# Altium project LAUNCHXL-F28379D.PrjPcb
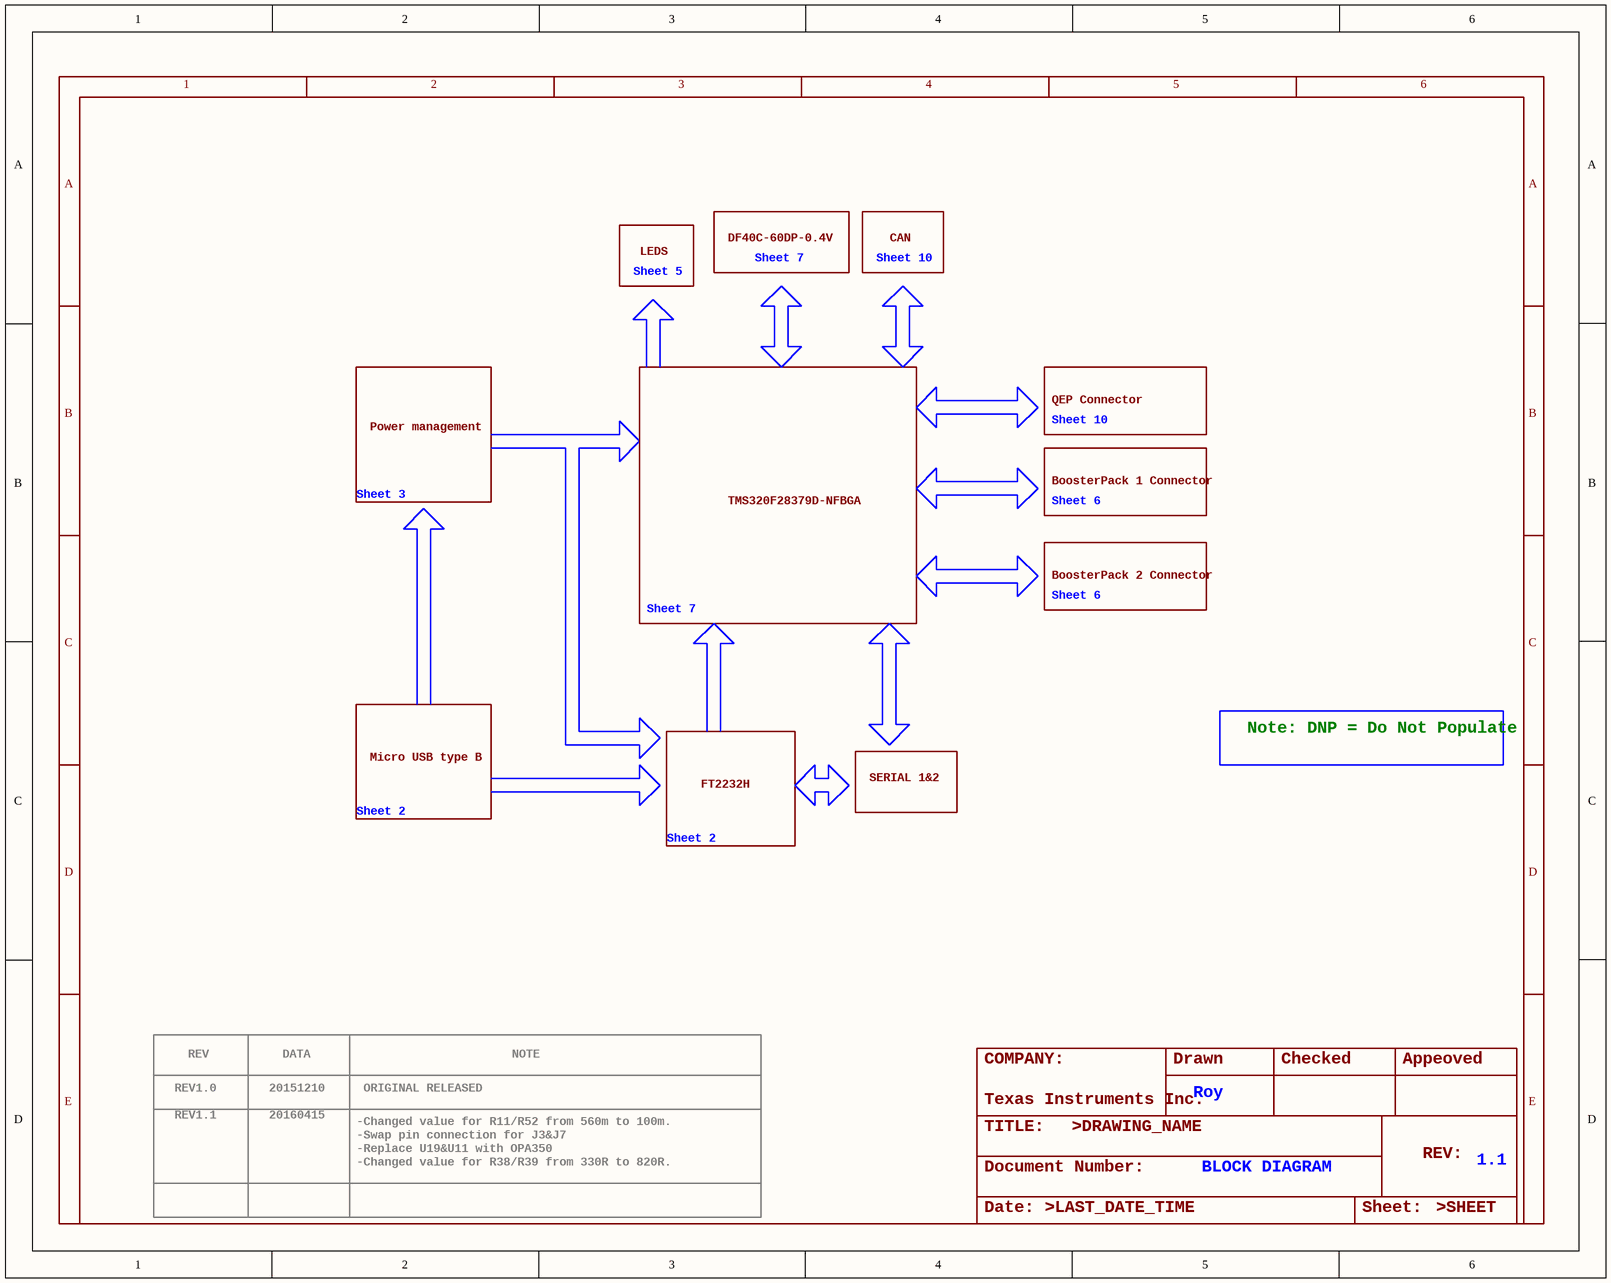
[diagram p0: LAUNCHXL-F28379D_0.SchDoc]
10 sheets, 230 parts. Net scope: global (net labels, ports and power ports of the same name join across sheets).
Sheets:
  LAUNCHXL-F28379D_0.SchDoc
  LAUNCHXL-F28379D_1.SchDoc
  LAUNCHXL-F28379D_2.SchDoc
  LAUNCHXL-F28379D_3.SchDoc
  LAUNCHXL-F28379D_4.SchDoc
  LAUNCHXL-F28379D_5.SchDoc
  LAUNCHXL-F28379D_6.SchDoc
  LAUNCHXL-F28379D_7.SchDoc
  LAUNCHXL-F28379D_8.SchDoc
  LAUNCHXL-F28379D_9.SchDoc

## Sheet LAUNCHXL-F28379D_0.SchDoc
size 301 x 239 mm

### Parts
FRAME3  FRAME_A_L  (value not drawn)

### Notes on the sheet
- Sheet 5
- LEDS
- DF40C-60DP-0.4V
- Sheet 7
- Sheet 10
- CAN
- QEP Connector
- Sheet 3
- Power management
- BoosterPack 1 Connector
- TMS320F28379D-NFBGA
- Sheet 6
- BoosterPack 2 Connector
- Micro USB type B
- Note: DNP = Do Not Populate
- Sheet 2
- FT2232H
- SERIAL 1&2
- REV1.0
- REV
- 20151210
- DATA
- ORIGINAL RELEASED
- NOTE
- COMPANY:
- Drawn
- Roy
- Checked
- Appeoved
- REV1.1
- 20160415
- -Changed value for R11/R52 from 560m to 100m.
- -Swap pin connection for J3&J7
- -Replace U19&U11 with OPA350
- -Changed value for R38/R39 from 330R to 820R.
- TITLE:
- Document Number:
- Texas
  Instruments Inc.
- >DRAWING_NAME
- BLOCK DIAGRAM
- REV:
- 1.1
- Date:
- >LAST_DATE_TIME
- Sheet:
- >SHEET
- (in symbol FRAME_A_L) 1; 2; 3; 4; 5; 6; A; B; C; D; E

### Library data of the parts
FRAME3 = FRAME_A_L: <b>FRAME</b> A Size , 8 1/2 x 11 INCH, Landscape<p>

## Sheet LAUNCHXL-F28379D_1.SchDoc
size 301 x 239 mm
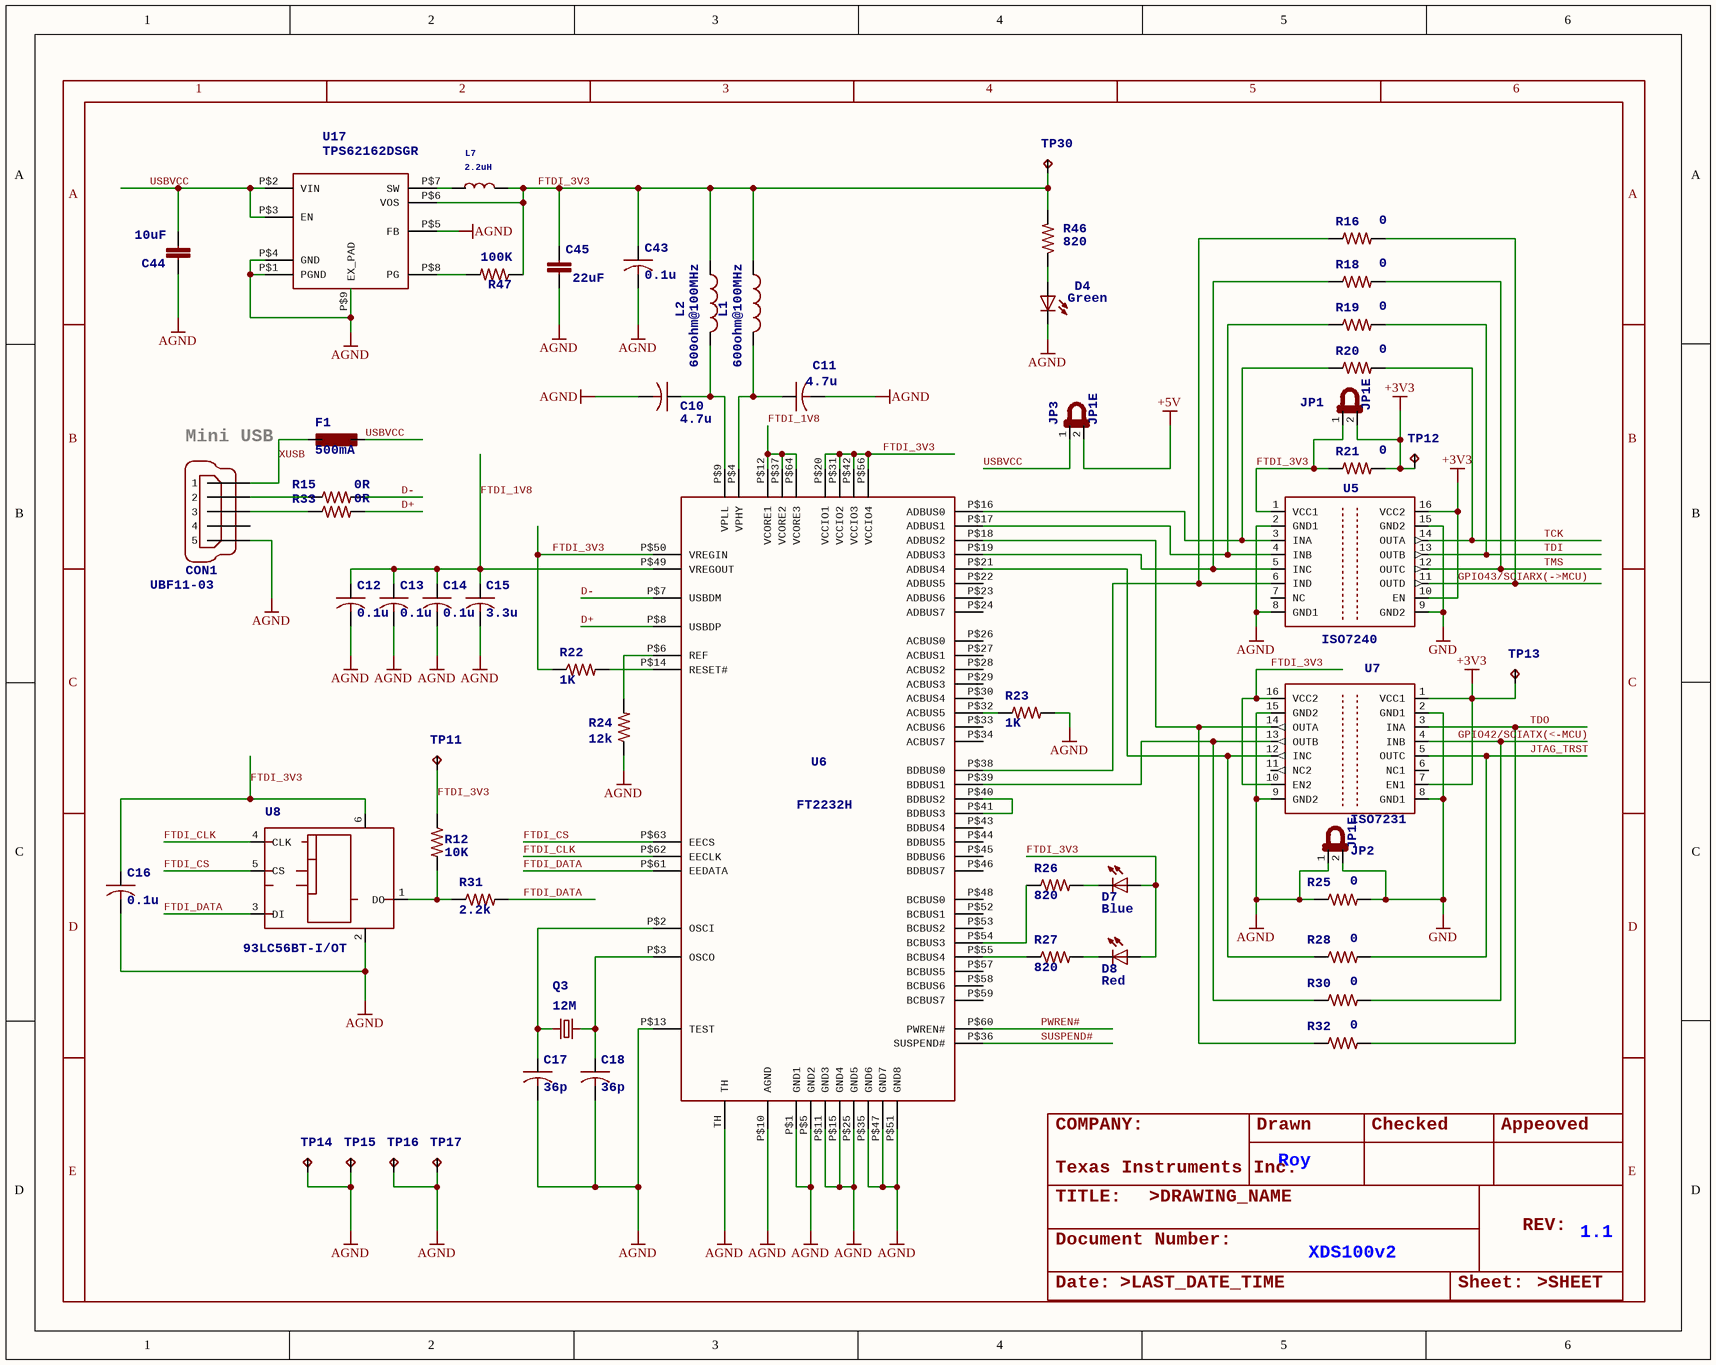
[diagram p1: LAUNCHXL-F28379D_1.SchDoc]

### Parts
C10  4.7u  [C0402]
C11  4.7u  [C0402]
C12  0.1u  [C0402]
C13  0.1u  [C0402]
C14  0.1u  [C0402]
C15  3.3u  [C0402]
C16  0.1u  [C0402]
C17  36p  [C0402]
C18  36p  [C0402]
C43  0.1u  [C0402]
C44  10uF  [SPARKFUN_1210]
C45  22uF  [SPARKFUN_1210]
CON1  UBF11-03  [32005-201]
D4  Green  [CHIP-LED0603]
D7  Blue  [CHIP-LED0603]
D8  Red  [CHIP-LED0603]
F1  500mA  [L1812]
JP1  JP1E  [JP1]
JP2  JP1E  [JP1]
JP3  JP1E  [JP1]
L1  600ohm@100MHz  [R0402]
L2  600ohm@100MHz  [R0402]
L7  2.2uH  [INDUCT-3.2*3.2]
Q3  12M  [HC49UP]
R12  10K  [R0402]
R15  0R  [R0402]
R16  0  [R1206]
R18  0  [R1206]
R19  0  [R1206]
R20  0  [R1206]
R21  0  [R1206]
R22  1K  [R0402]
R23  1K  [R0402]
R24  12k  [R0402]
R25  0  [R1206]
R26  820  [R0402]
R27  820  [R0402]
R28  0  [R1206]
R30  0  [R1206]
R31  2.2k  [R0402]
R32  0  [R1206]
R33  0R  [R0402]
R46  820  [R0402]
R47  100K  [R0402]
TP11  TESTPAD_TPB1,27  [TESTPAD_B1,27]  (value not drawn)
TP12  TESTPAD_TPB1,27  [TESTPAD_B1,27]  (value not drawn)
TP13  TESTPAD_TPB1,27  [TESTPAD_B1,27]  (value not drawn)
TP14  TESTPAD_TPB1,27  [TESTPAD_B1,27]  (value not drawn)
TP15  TESTPAD_TPB1,27  [TESTPAD_B1,27]  (value not drawn)
TP16  TESTPAD_TPB1,27  [TESTPAD_B1,27]  (value not drawn)
TP17  TESTPAD_TPB1,27  [TESTPAD_B1,27]  (value not drawn)
TP30  TESTPAD_TPB1,27  [TESTPAD_B1,27]  (value not drawn)
U5  ISO7240  [SO-16DW]
U6  FT2232H  [QFN64]
U7  ISO7231  [SO-16DW]
U8  93LC56BT-I/OT  [SOT23-6]
U17  TPS62162DSGR  [TI_DSG8]
U$2  ROY_JUMPER  [ROY_JUMPER]  (value not drawn)
U$10  ROY_JUMPER  [ROY_JUMPER]  (value not drawn)
U$11  ROY_JUMPER  [ROY_JUMPER]  (value not drawn)

### Nets
+5V: JP3.2
AGND: C10.2 C11.2 C12.2 C13.2 C14.2 C15.2 C16.2 C17.2 C18.2 C43.2 C44.1 C45.1 CON1.5 D4.C JP2.1 R23.2 R24.1 R25.1 TP14.TP TP15.TP TP16.TP TP17.TP U5.2(GND1) U5.8(GND1) U6.P$1(GND1) U6.P$5(GND2) U6.P$10(AGND) U6.P$11(GND3) U6.P$13(TEST) U6.P$15(GND4) U6.P$25(GND5) U6.P$35(GND6) U6.P$47(GND7) U6.P$51(GND8) U6.TH U7.9(GND2) U7.15(GND2) U8.2(GND) U17.P$1(PGND) U17.P$4(GND) U17.P$5(FB) U17.P$9(EX_PAD)
GND: JP2.2 R25.2 U5.9(GND2) U5.15(GND2) U7.2(GND1) U7.8(GND1)
GPIO43/SCIARX(->MCU): JP1.2 R16.2 R21.2 TP12.TP TP13.TP U5.10(EN) U5.11(OUTD) U5.16(VCC2) U7.1(VCC1) U7.7(EN1)  [also labelled +3V3]
D+: R33.2 U6.P$8(USBDP)
D-: R15.2 U6.P$7(USBDM)
FTDI_1V8: C12.1 C13.1 C14.1 C15.1 U6.P$12(VCORE1) U6.P$37(VCORE2) U6.P$49(VREGOUT) U6.P$64(VCORE3)
FTDI_3V3: C16.1 C43.1 C45.2 D7.A D8.A JP1.1 L1.1 L2.1 L7.P$1 R12.1 R21.1 R22.1 R46.2 R47.1 TP11.TP TP30.TP U5.1(VCC1) U6.P$20(VCCIO1) U6.P$31(VCCIO2) U6.P$42(VCCIO3) U6.P$50(VREGIN) U6.P$56(VCCIO4) U7.10(EN2) U7.16(VCC2) U8.6(VCC) U17.P$6(VOS)
FTDI_CLK: U6.P$62(EECLK) U8.4(CLK)
FTDI_CS: U6.P$63(EECS) U8.5(CS)
FTDI_DATA: R31.2 U6.P$61(EEDATA) U8.3(DI)
GPIO42/SCIATX(<-MCU): R30.2 U7.4(INB)
JTAG_TRST: R28.2 U7.5(OUTC)
PWREN#: U6.P$60(PWREN#)
SUSPEND#: U6.P$36(SUSPEND#)
TCK: R20.2 U5.14(OUTA)
TDI: R19.2 U5.13(OUTB)
TDO: R32.2 U7.3(INA)
TMS: R18.2 U5.12(OUTC)
USBVCC: C44.2 F1.1 JP3.1 U17.P$2(VIN) U17.P$3(EN)
XUSB: CON1.1 F1.2
NetC10_1: C10.1 L2.2 U6.P$9(VPLL)
NetC11_1: C11.1 L1.2 U6.P$4(VPHY)
NetC17_1: C17.1 Q3.1 U6.P$2(OSCI)
NetC18_1: C18.1 Q3.2 U6.P$3(OSCO)
NetCON1_2: CON1.2 R15.1
NetCON1_3: CON1.3 R33.1
NetD4_A: D4.A R46.1
NetD7_C: D7.C R26.2
NetD8_C: D8.C R27.2
NetL7_P$2: L7.P$2 U17.P$7(SW)
NetR12_2: R12.2 R31.1 U8.1(DO)
NetR16_1: R16.1 U5.6(IND) U6.P$38(BDBUS0)
NetR18_1: R18.1 U5.5(INC) U6.P$19(ADBUS3)
NetR19_1: R19.1 U5.4(INB) U6.P$17(ADBUS1)
NetR20_1: R20.1 U5.3(INA) U6.P$16(ADBUS0)
NetR22_2: R22.2 U6.P$14(RESET#)
NetR23_1: R23.1 U6.P$32(ACBUS5)
NetR24_2: R24.2 U6.P$6(REF)
NetR26_1: R26.1 U6.P$54(BCBUS3)
NetR27_1: R27.1 U6.P$55(BCBUS4)
NetR28_1: R28.1 U6.P$21(ADBUS4) U7.12(INC)
NetR30_1: R30.1 U6.P$39(BDBUS1) U7.13(OUTB)
NetR32_1: R32.1 U6.P$18(ADBUS2) U7.14(OUTA)
NetR47_2: R47.2 U17.P$8(PG)
NetU6_P$40: U6.P$40(BDBUS2) U6.P$41(BDBUS3)

Not connected (* = marked no-connect by the designer): CON1 4; U5 7(NC); U6 P$22(ADBUS5) P$23(ADBUS6) P$24(ADBUS7) P$26(ACBUS0) P$27(ACBUS1) P$28(ACBUS2) P$29(ACBUS3) P$30(ACBUS4) P$33(ACBUS6) P$34(ACBUS7) P$43(BDBUS4) P$44(BDBUS5) P$45(BDBUS6) P$46(BDBUS7) P$48(BCBUS0) P$52(BCBUS1) P$53(BCBUS2) P$57(BCBUS5) P$58(BCBUS6) P$59(BCBUS7); U7 6(NC1) 11(NC2)

### Notes on the sheet
- (near CON1) Mini USB
- COMPANY:
- Texas
  Instruments Inc.
- Drawn
- Roy
- Checked
- Appeoved
- TITLE:
- Document Number:
- >DRAWING_NAME
- REV:
- 1.1
- Date:
- >LAST_DATE_TIME
- XDS100v2
- Sheet:
- >SHEET
- 1
- 2
- 3
- 4
- 5
- 6
- A
- B
- C
- D
- E

### Library data of the parts
C10-C18 C43 = C-USC0402: <B>CAPACITOR</B>, American symbol
C44 C45 = SPARKFUN_CAP1210: <b>Capacitor</b> / Standard 0603 ceramic capacitor, and 0.1" leaded capacitor.
CON1 = MINI-USB-32005-201: <b>MINI USB-B Conector</b><p> / Source: www.cypressindustries.com
D4 D7 D8 = LEDCHIP-LED0603: <b>LED</b><p> / <u>OSRAM</u>:<br> / - <u>CHIPLED</u><br> / LG R971, LG N971, LY N971, LG Q971, LY Q971, LO R971, LY R971 / LH N974, LH R974<br> / LS Q976, LO Q976, LY Q976<br> / LO Q996<br> / - <u>Hyper CHIPLED</u><br> / LW Q18S<br> / LB Q993, LB Q99A, LB R99A<br> / - <u>SideLED</u><br> / LS A670, LO A670, LY A670, LG A670, LP A670<br> / LB A673, LV A673, LT A673, LW A673<br> / LH A674<br> / LY A675<br> / LS A676, LA A676, LO A676, LY A676, LW A676<br> / LS A679, LY A679, LG A679<br> / -  <u>Hyper Micro SIDELED®</u><br> / LS Y876, LA Y876, LO Y876, LY Y876<br> / LT Y87S<br> / - <u>SmartLED</u><br> / LW L88C, LW L88S<br> / LB L89C, LB L89S, LG L890<br> / LS L89K, LO L89K, LY L89K<br> / LS L896, LA L896, LO L896, LY L896<br> / - <u>TOPLED</u><br> / LS T670, LO T670, LY T670, LG T670, LP T670<br> / LSG T670, LSP T670, LSY T670, LOP T670, LYG T670<br> / LG T671, LOG T671, LSG T671<br> / LB T673, LV T673, LT T673, LW T673<br> / LH T674<br> / LS T676, LA T676, LO T676, LY T676, LB T676, LH T676, LSB T676, LW T676<br> / LB T67C, LV T67C, LT T67C, LS T67K, LO T67K, LY T67K, LW E67C<br> / LS E67B, LA E67B, LO E67B, LY E67B, LB E67C, LV E67C, LT E67C<br> / LW T67C<br> / LS T679, LY T679, LG T679<br> / LS T770, LO T770, LY T770, LG T770, LP T770<br> / LB T773, LV T773, LT T773, LW T773<br> / LH T774<br> / LS E675, LA E675, LY E675, LS T675<br> / LS T776, LA T776, LO T776, LY T776, LB T776<br> / LHGB T686<br> / LT T68C, LB T68C<br> / - <u>Hyper Mini TOPLED®</u><br> / LB M676<br> / - <u>Mini TOPLED Santana®</u><br> / LG M470<br> / LS M47K, LO M47K, LY M47K / <p> / Source: http://www.osram.convergy.de<p> / <u>LUXEON:</u><br> / - <u>LUMILED®</u><br> / LXK2-PW12-R00, LXK2-PW12-S00, LXK2-PW14-U00, LXK2-PW14-V00<br> / LXK2-PM12-R00, LXK2-PM12-S00, LXK2-PM14-U00<br> / LXK2-PE12-Q00, LXK2-PE12-R00, LXK2-PE12-S00, LXK2-PE14-T00, LXK2-PE14-U00<br> / LXK2-PB12-K00, LXK2-PB12-L00, LXK2-PB12-M00, LXK2-PB14-N00, LXK2-PB14-P00, LXK2-PB14-Q00<br> / LXK2-PR12-L00, LXK2-PR12-M00, LXK2-PR14-Q00, LXK2-PR14-R00<br> / LXK2-PD12-Q00, LXK2-PD12-R00, LXK2-PD12-S00<br> / LXK2-PH12-R00, LXK2-PH12-S00<br> / LXK2-PL12-P00, LXK2-PL12-Q00, LXK2-PL12-R00 / <p> / Source: www.luxeon.com<p> / <u>KINGBRIGHT:</U><p> / KA-3528ASYC<br> / Source: www.kingbright.com
F1 = L-EUL1812: <B>INDUCTOR</B>, European symbol
JP1-JP3 = JP1E: <b>JUMPER</b>
L1 L2 = L-US0402: <B>INDUCTOR</B>, American symbol
L7 = VLF4012A`
Q3 = CRYSTALHC49UP: <b>CRYSTAL</b>
R12 R15 R22-R24 R26 R27 R31 R33 R46 R47 = R-US_R0402: <B>RESISTOR</B>, American symbol
R16 R18-R21 R25 R28 R30 R32 = R-US_R1206: <B>RESISTOR</B>, American symbol
TP11-TP17 TP30 = TESTPAD_TPB1,27: <b>Test pad</b>
U5 = ISO7240: <b>HIGH SPEED QUAD DIGITAL ISOLATORS</b><p> / Source: http://focus.ti.com/lit/ds/symlink/iso7240m.pdf
U8 = 93*: Serial <B>EPROM</B><p> / 1 K/2 K/4 K, low voltage, Microwire

## Sheet LAUNCHXL-F28379D_2.SchDoc
size 301 x 239 mm
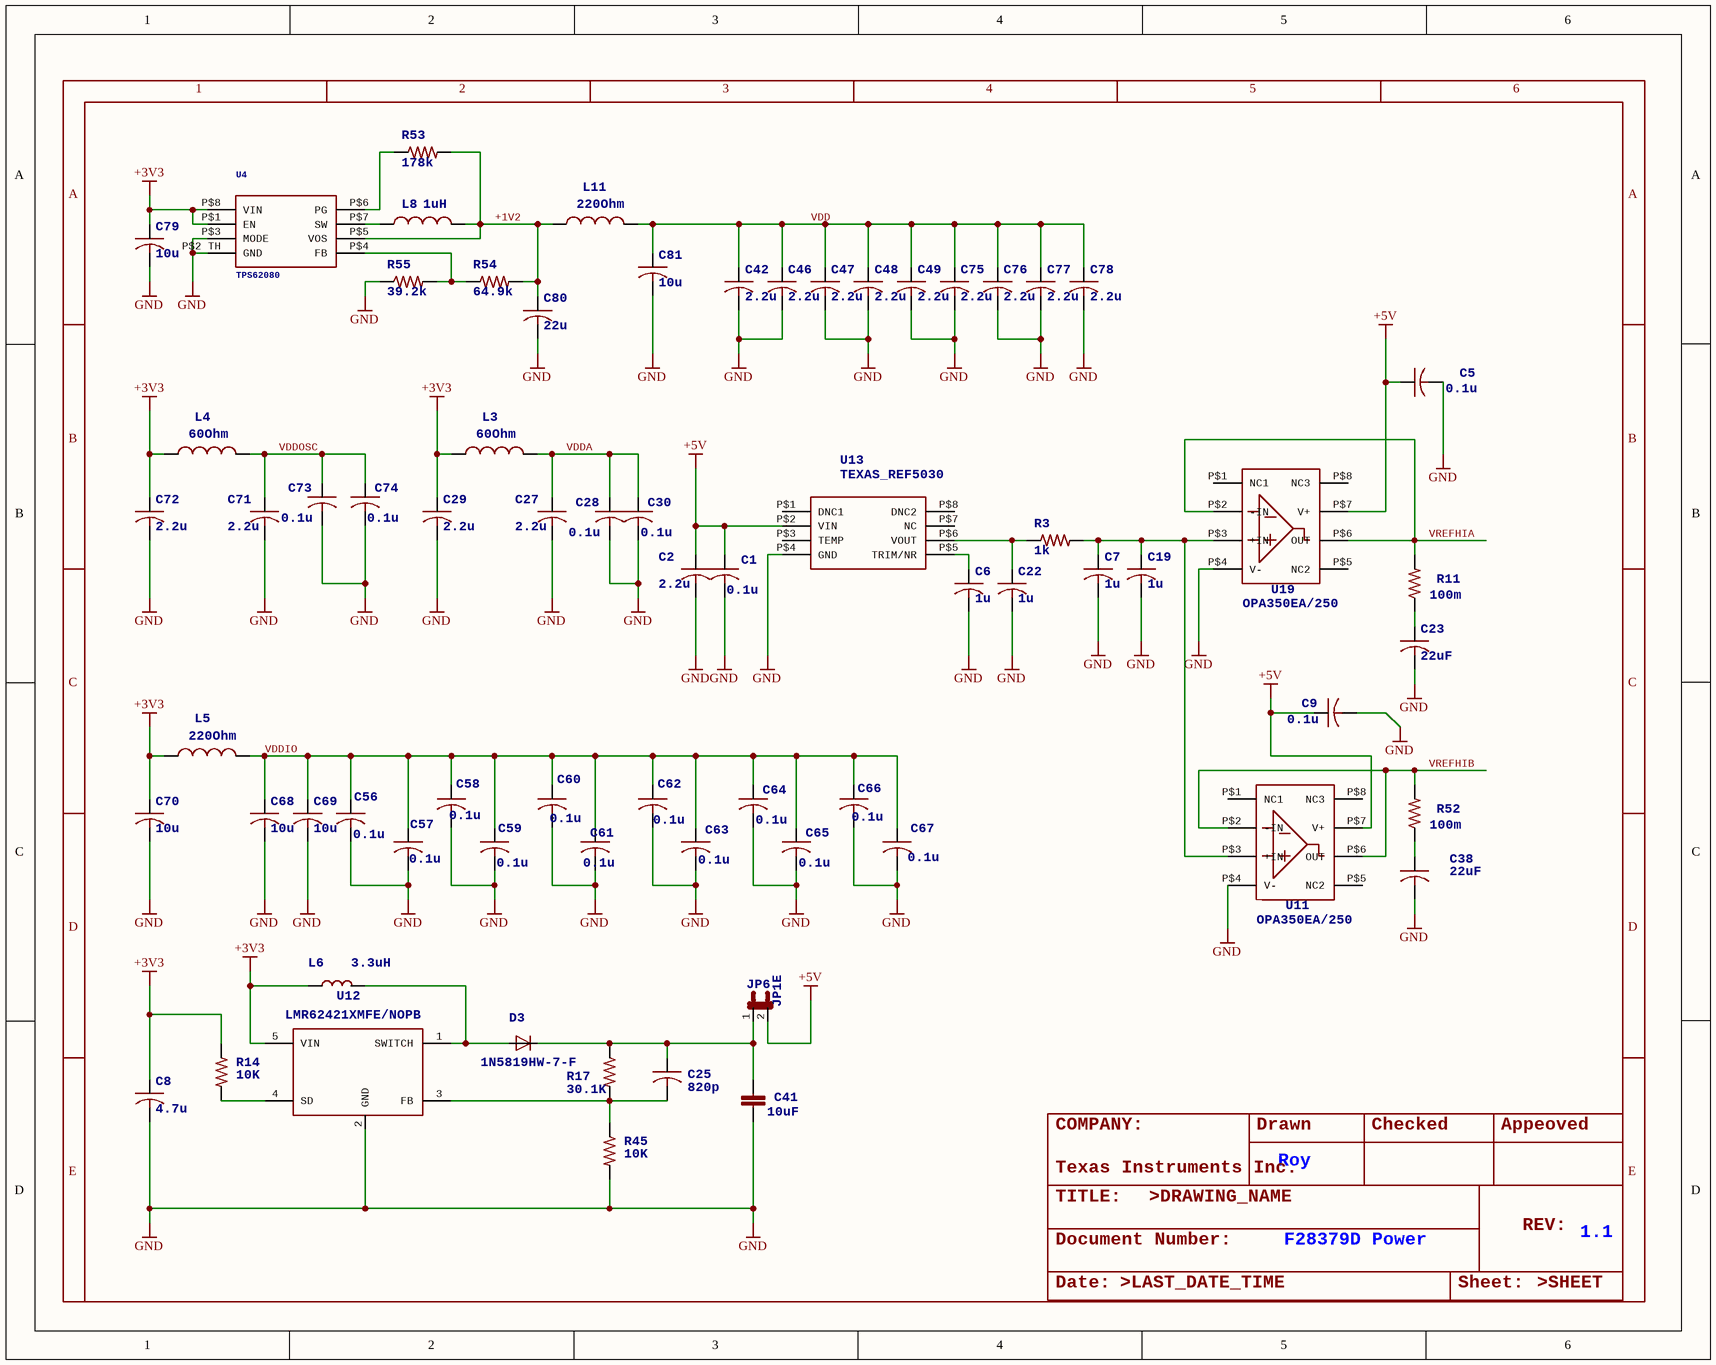
[diagram p2: LAUNCHXL-F28379D_2.SchDoc]

### Parts
C1  0.1u  [C0402]
C2  2.2u  [C0402]
C5  0.1u  [C0402]
C6  1u  [C0402]
C7  1u  [C0402]
C8  4.7u  [C0402]
C9  0.1u  [C0402]
C19  1u  [C0402]
C22  1u  [C0402]
C23  22uF  [C0603]
C25  820p  [C0402]
C27  2.2u  [C0402]
C28  0.1u  [C0402]
C29  2.2u  [C0402]
C30  0.1u  [C0402]
C38  22uF  [C0603]
C41  10uF  [SPARKFUN_1210]
C42  2.2u  [C0402]
C46  2.2u  [C0402]
C47  2.2u  [C0402]
C48  2.2u  [C0402]
C49  2.2u  [C0402]
C56  0.1u  [C0402]
C57  0.1u  [C0402]
C58  0.1u  [C0402]
C59  0.1u  [C0402]
C60  0.1u  [C0402]
C61  0.1u  [C0402]
C62  0.1u  [C0402]
C63  0.1u  [C0402]
C64  0.1u  [C0402]
C65  0.1u  [C0402]
C66  0.1u  [C0402]
C67  0.1u  [C0402]
C68  10u  [C0603]
C69  10u  [C0603]
C70  10u  [C0603]
C71  2.2u  [C0402]
C72  2.2u  [C0402]
C73  0.1u  [C0402]
C74  0.1u  [C0402]
C75  2.2u  [C0402]
C76  2.2u  [C0402]
C77  2.2u  [C0402]
C78  2.2u  [C0402]
C79  10u  [C0603]
C80  22u  [C0603]
C81  10u  [C0603]
D3  1N5819HW-7-F  [SOD123]
JP6  JP1E  [JP1]
L3  60Ohm  [R0402]
L4  60Ohm  [R0402]
L5  220Ohm  [R0402]
L6  3.3uH  [INDUCT-3_7*3_5]
L8  1uH  [L1212]
L11  220Ohm  [R0402]
R3  1k  [R0402]
R11  100m  [R0402]
R14  10K  [R0402]
R17  30.1K  [R0402]
R45  10K  [R0402]
R52  100m  [R0402]
R53  178k  [R0402]
R54  64.9k  [R0402]
R55  39.2k  [R0402]
U4  TPS62080  [SON8]
U11  OPA350EA/250  [OPA350_OPA350]
U12  LMR62421XMFE/NOPB  [SOT23-5-DBV]
U13  TEXAS_REF5030  [TEXAS_REF5030]
U19  OPA350EA/250  [OPA350_OPA350]

### Nets
+3V3: C8.1 C29.1 C70.1 C72.1 C79.1 L3.1 L4.1 L5.1 L6.P$1 R14.1 U4.P$1(EN) U4.P$8(VIN) U12.5(VIN)  [project net GPIO43/SCIARX(->MCU)]
+5V: C1.1 C2.1 C5.1 C9.1 JP6.2 U11.P$7(V+) U13.P$2(VIN) U19.P$7(V+)
GND: C1.2 C2.2 C5.2 C6.2 C7.2 C8.2 C9.2 C19.2 C22.2 C23.2 C27.2 C28.2 C29.2 C30.2 C38.2 C41.1 C42.2 C46.2 C47.2 C48.2 C49.2 C56.2 C57.2 C58.2 C59.2 C60.2 C61.2 C62.2 C63.2 C64.2 C65.2 C66.2 C67.2 C68.2 C69.2 C70.2 C71.2 C72.2 C73.2 C74.2 C75.2 C76.2 C77.2 C78.2 C79.2 C80.2 C81.2 R45.2 R55.1 U4.P$2_TH(GND) U4.P$3(MODE) U11.P$4(V-) U12.2(GND) U13.P$4(GND) U19.P$4(V-)
+1V2: C80.1 L8.P$2 L11.1 R53.2 R54.2 U4.P$5(VOS)
VDD: C42.1 C46.1 C47.1 C48.1 C49.1 C75.1 C76.1 C77.1 C78.1 C81.1 L11.2
VDDA: C27.1 C28.1 C30.1 L3.2
VDDIO: C56.1 C57.1 C58.1 C59.1 C60.1 C61.1 C62.1 C63.1 C64.1 C65.1 C66.1 C67.1 C68.1 C69.1 L5.2
VDDOSC: C71.1 C73.1 C74.1 L4.2
VREFHIA: R11.2 U19.P$2(-IN) U19.P$6(OUT)
VREFHIB: R52.2 U11.P$2(-IN) U11.P$6(OUT)
NetC6_1: C6.1 U13.P$5(TRIM/NR)
NetC7_1: C7.1 C19.1 R3.2 U11.P$3(+IN) U19.P$3(+IN)
NetC22_1: C22.1 R3.1 U13.P$6(VOUT)
NetC23_1: C23.1 R11.1
NetC25_1: C25.1 C41.2 D3.C JP6.1 R17.1
NetC25_2: C25.2 R17.2 R45.1 U12.3(FB)
NetC38_1: C38.1 R52.1
NetD3_A: D3.A L6.P$2 U12.1(SWITCH)
NetL8_P$1: L8.P$1 U4.P$7(SW)
NetR14_2: R14.2 U12.4(SD)
NetR53_1: R53.1 U4.P$6(PG)
NetR54_1: R54.1 R55.2 U4.P$4(FB)

Not connected (* = marked no-connect by the designer): U11 P$1(NC1) P$5(NC2) P$8(NC3); U13 P$1(DNC1) P$3(TEMP) P$7(NC) P$8(DNC2); U19 P$1(NC1) P$5(NC2) P$8(NC3)

### Notes on the sheet
- COMPANY:
- Texas
  Instruments Inc.
- Drawn
- Roy
- Checked
- Appeoved
- TITLE:
- Document Number:
- >DRAWING_NAME
- F28379D Power
- REV:
- 1.1
- Date:
- >LAST_DATE_TIME
- Sheet:
- >SHEET
- 1
- 2
- 3
- 4
- 5
- 6
- A
- B
- C
- D
- E

### Library data of the parts
C1 C2 C5-C9 C19 C22 C25 C27-C30 C42 C46-C49 C56-C67 C71-C78 = C-USC0402: <B>CAPACITOR</B>, American symbol
C23 C38 C68-C70 C79-C81 = C-USC0603: <B>CAPACITOR</B>, American symbol
C41 = SPARKFUN_CAP1210: as C44 on sheet LAUNCHXL-F28379D_1
D3 = 1N4148: <B>DIODE</B><p> / high speed (Philips)
JP6 = JP1E: <b>JUMPER</b>
L3-L5 L11 = L-US0402: <B>INDUCTOR</B>, American symbol
L6 = VLF4012A
L8 = L-USL1212: <B>INDUCTOR</B>, American symbol
R3 R11 R14 R17 R45 R52-R55 = R-US_R0402: <B>RESISTOR</B>, American symbol
U11 U19 = OPA350_OPA350

## Sheet LAUNCHXL-F28379D_3.SchDoc
size 301 x 239 mm
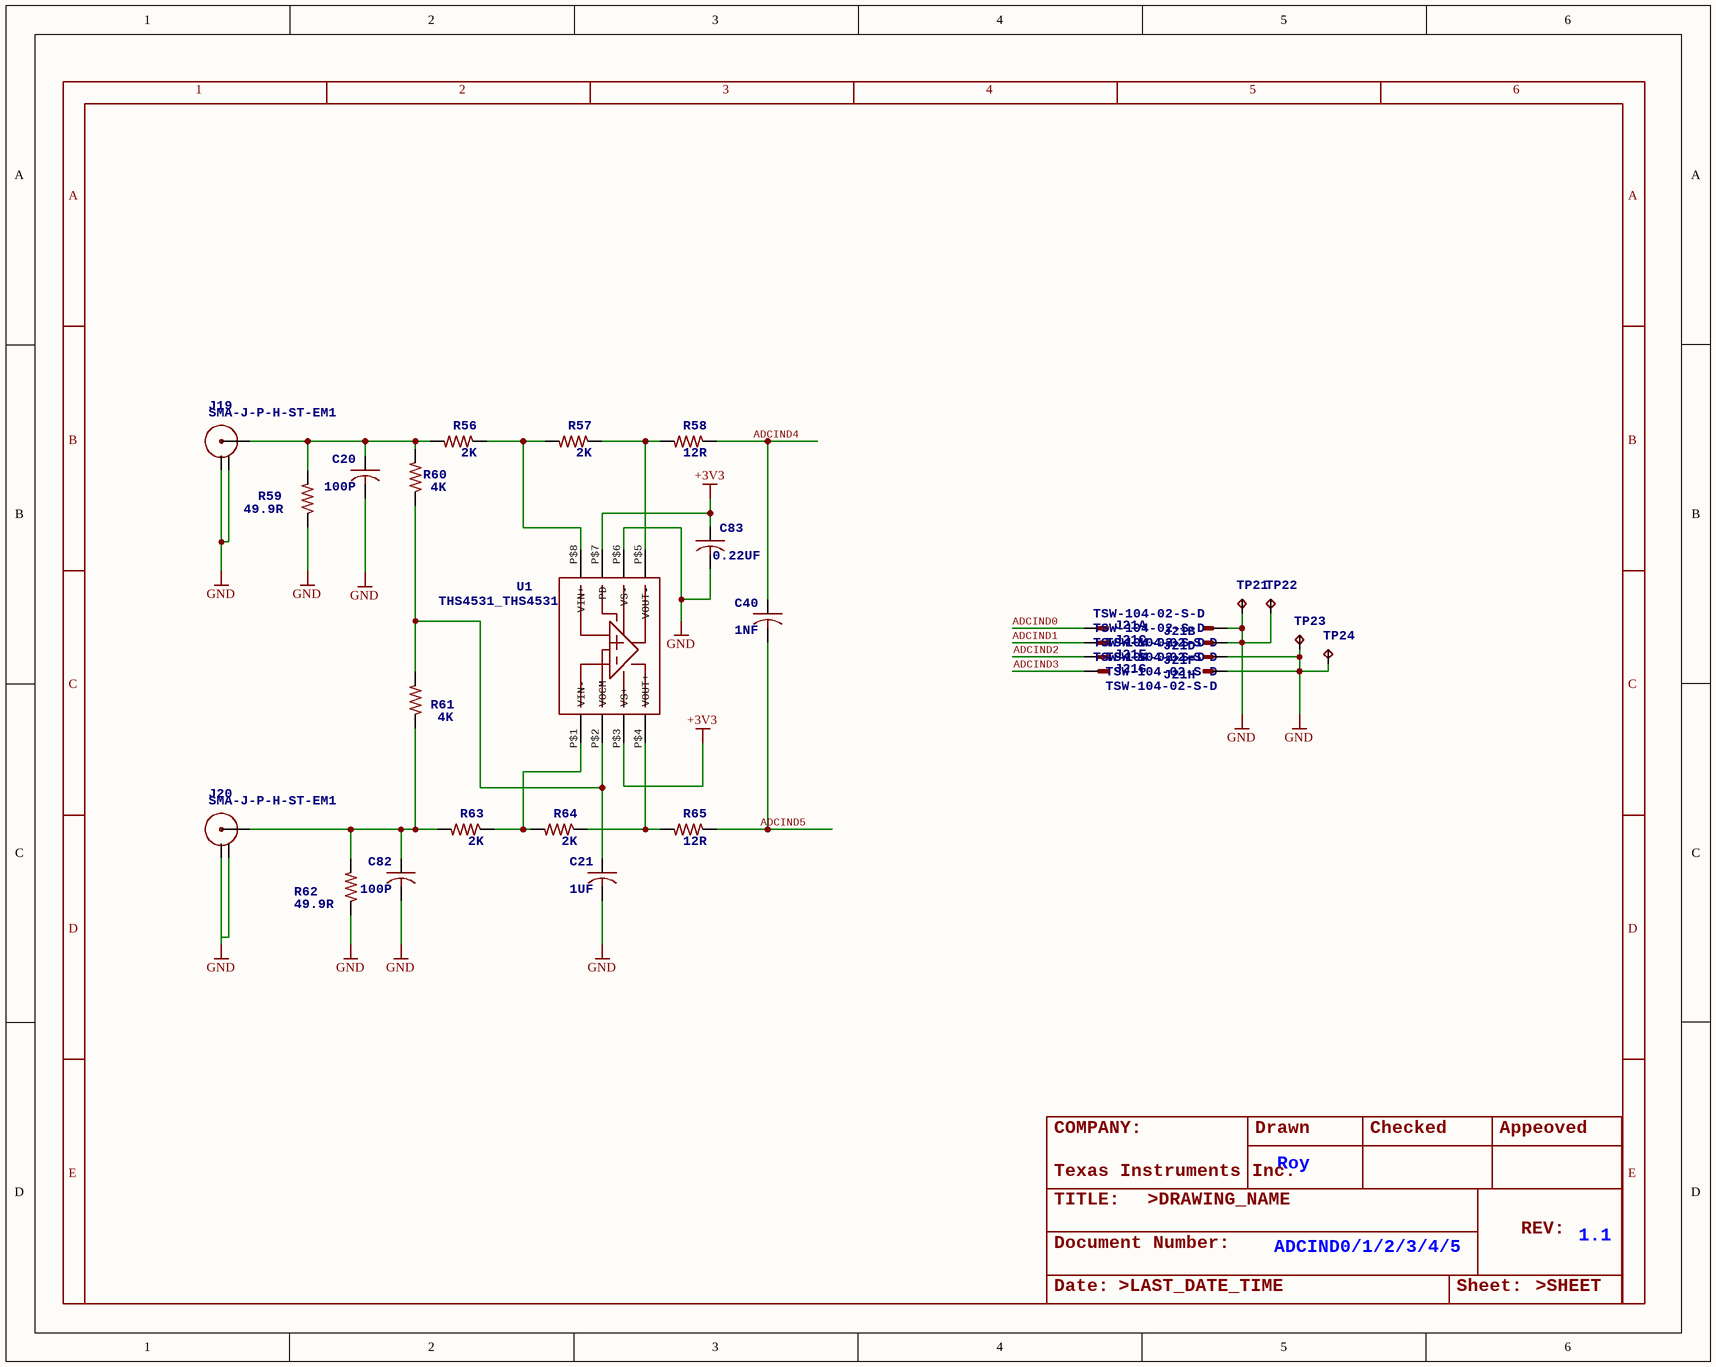
[diagram p3: LAUNCHXL-F28379D_3.SchDoc]

### Parts
C20  100P  [C0402]
C21  1UF  [C0402]
C40  1NF  [C0402]
C82  100P  [C0402]
C83  0.22UF  [C0402]
J19  SMA-J-P-H-ST-EM1  [SMA_EM]
J20  SMA-J-P-H-ST-EM1  [SMA_EM]
J21  TSW-104-02-S-D  [TSW-104-02-S-D]  (parts A,B,C,D,E,F,G,H of 8)
R56  2K  [R0402]
R57  2K  [R0402]
R58  12R  [R0402]
R59  49.9R  [R0402]
R60  4K  [R0402]
R61  4K  [R0402]
R62  49.9R  [R0402]
R63  2K  [R0402]
R64  2K  [R0402]
R65  12R  [R0402]
TP21  TESTPAD_TPB1,27  [TESTPAD_B1,27]  (value not drawn)
TP22  TESTPAD_TPB1,27  [TESTPAD_B1,27]  (value not drawn)
TP23  TESTPAD_TPB1,27  [TESTPAD_B1,27]  (value not drawn)
TP24  TESTPAD_TPB1,27  [TESTPAD_B1,27]  (value not drawn)
U1  THS4531_THS4531  [THS4531_THS4531]

### Nets
+3V3: C83.1 U1.P$3(VS+) U1.P$7(PD)  [project net GPIO43/SCIARX(->MCU)]
GND: C20.2 C21.2 C82.2 C83.2 J19.1 J19.3_4_5 J20.1 J20.3_4_5 J21.2 J21.4 J21.6 J21.8 R59.1 R62.1 TP21.TP TP22.TP TP23.TP TP24.TP U1.P$6(VS-)
ADCIND0: J21.1
ADCIND1: J21.3
ADCIND2: J21.5
ADCIND3: J21.7
ADCIND4: C40.1 R58.1
ADCIND5: C40.2 R65.1
NetC20_1: C20.1 J19.2 R56.2 R59.2 R60.2
NetC21_1: C21.1 R60.1 R61.2 U1.P$2(VOCM)
NetC82_1: C82.1 J20.2 R61.1 R62.2 R63.2
NetR56_1: R56.1 R57.2 U1.P$8(VIN+)
NetR57_1: R57.1 R58.2 U1.P$5(VOUT-)
NetR63_1: R63.1 R64.2 U1.P$1(VIN-)
NetR64_1: R64.1 R65.2 U1.P$4(VOUT+)

### Notes on the sheet
- COMPANY:
- Drawn
- Roy
- Checked
- Appeoved
- TITLE:
- Document Number:
- Texas
  Instruments Inc.
- >DRAWING_NAME
- REV:
- 1.1
- Date:
- >LAST_DATE_TIME
- ADCIND0/1/2/3/4/5
- Sheet:
- >SHEET
- 1
- 2
- 3
- 4
- 5
- 6
- A
- B
- C
- D
- E

### Library data of the parts
C20 C21 C40 C82 C83 = C-USC0402: <B>CAPACITOR</B>, American symbol
J19 J20 = SMA
J21 = TSW-104-02-S-D: <b>THROUGH-HOLE .025" SQ POST HEADER</b><p> / Source: Samtec TSW.pdf; OC_FARNELL: unknown; OC_NEWARK: unknown
R56-R65 = R-US_R0402: <B>RESISTOR</B>, American symbol
TP21-TP24 = TESTPAD_TPB1,27: <b>Test pad</b>

## Sheet LAUNCHXL-F28379D_4.SchDoc
size 301 x 239 mm
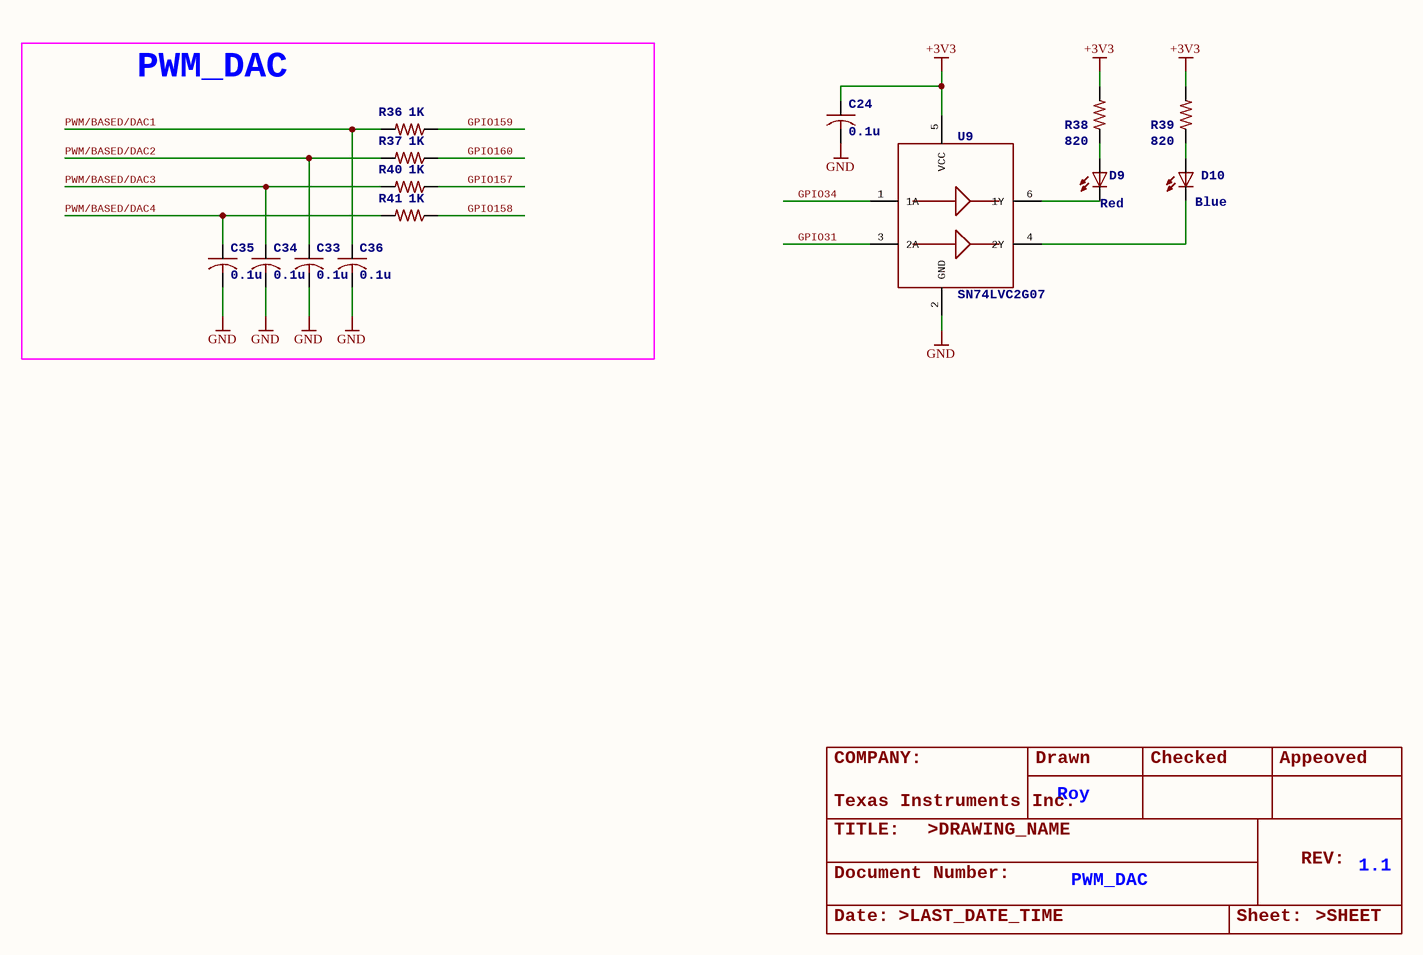
[diagram p4: LAUNCHXL-F28379D_4.SchDoc]

### Parts
C24  0.1u  [C0402]
C33  0.1u  [C0402]
C34  0.1u  [C0402]
C35  0.1u  [C0402]
C36  0.1u  [C0402]
D9  Red  [CHIP-LED0603]
D10  Blue  [CHIP-LED0603]
R36  1K  [R0402]
R37  1K  [R0402]
R38  820  [R0402]
R39  820  [R0402]
R40  1K  [R0402]
R41  1K  [R0402]
U9  SN74LVC2G07  [SOT23-6-DBV]

### Blocks framed on the sheet
PWM_DAC: C33-C36 R36 R37 R40 R41

### Nets
+3V3: C24.1 R38.2 R39.2 U9.5(VCC)  [project net GPIO43/SCIARX(->MCU)]
GND: C24.2 C33.2 C34.2 C35.2 C36.2 U9.2(GND)
GPIO31: U9.3(2A)
GPIO34: U9.1(1A)
GPIO157: R40.1
GPIO158: R41.1
GPIO159: R36.1
GPIO160: R37.1
PWM/BASED/DAC1: C36.1 R36.2
PWM/BASED/DAC2: C33.1 R37.2
PWM/BASED/DAC3: C34.1 R40.2
PWM/BASED/DAC4: C35.1 R41.2
NetD9_A: D9.A R38.1
NetD9_C: D9.C U9.6(1Y)
NetD10_A: D10.A R39.1
NetD10_C: D10.C U9.4(2Y)

### Notes on the sheet
- COMPANY:
- Drawn
- Roy
- Checked
- Appeoved
- TITLE:
- Document Number:
- Texas
  Instruments Inc.
- >DRAWING_NAME
- REV:
- 1.1
- Date:
- >LAST_DATE_TIME
- PWM_DAC
- Sheet:
- >SHEET
- 1
- 2
- 3
- 4
- 5
- 6
- A
- B
- C
- D
- E

### Library data of the parts
C24 C33-C36 = C-USC0402: <B>CAPACITOR</B>, American symbol
D9 D10 = LEDCHIP-LED0603: as D4 on sheet LAUNCHXL-F28379D_1
R36-R41 = R-US_R0402: <B>RESISTOR</B>, American symbol

## Sheet LAUNCHXL-F28379D_5.SchDoc
size 301 x 239 mm
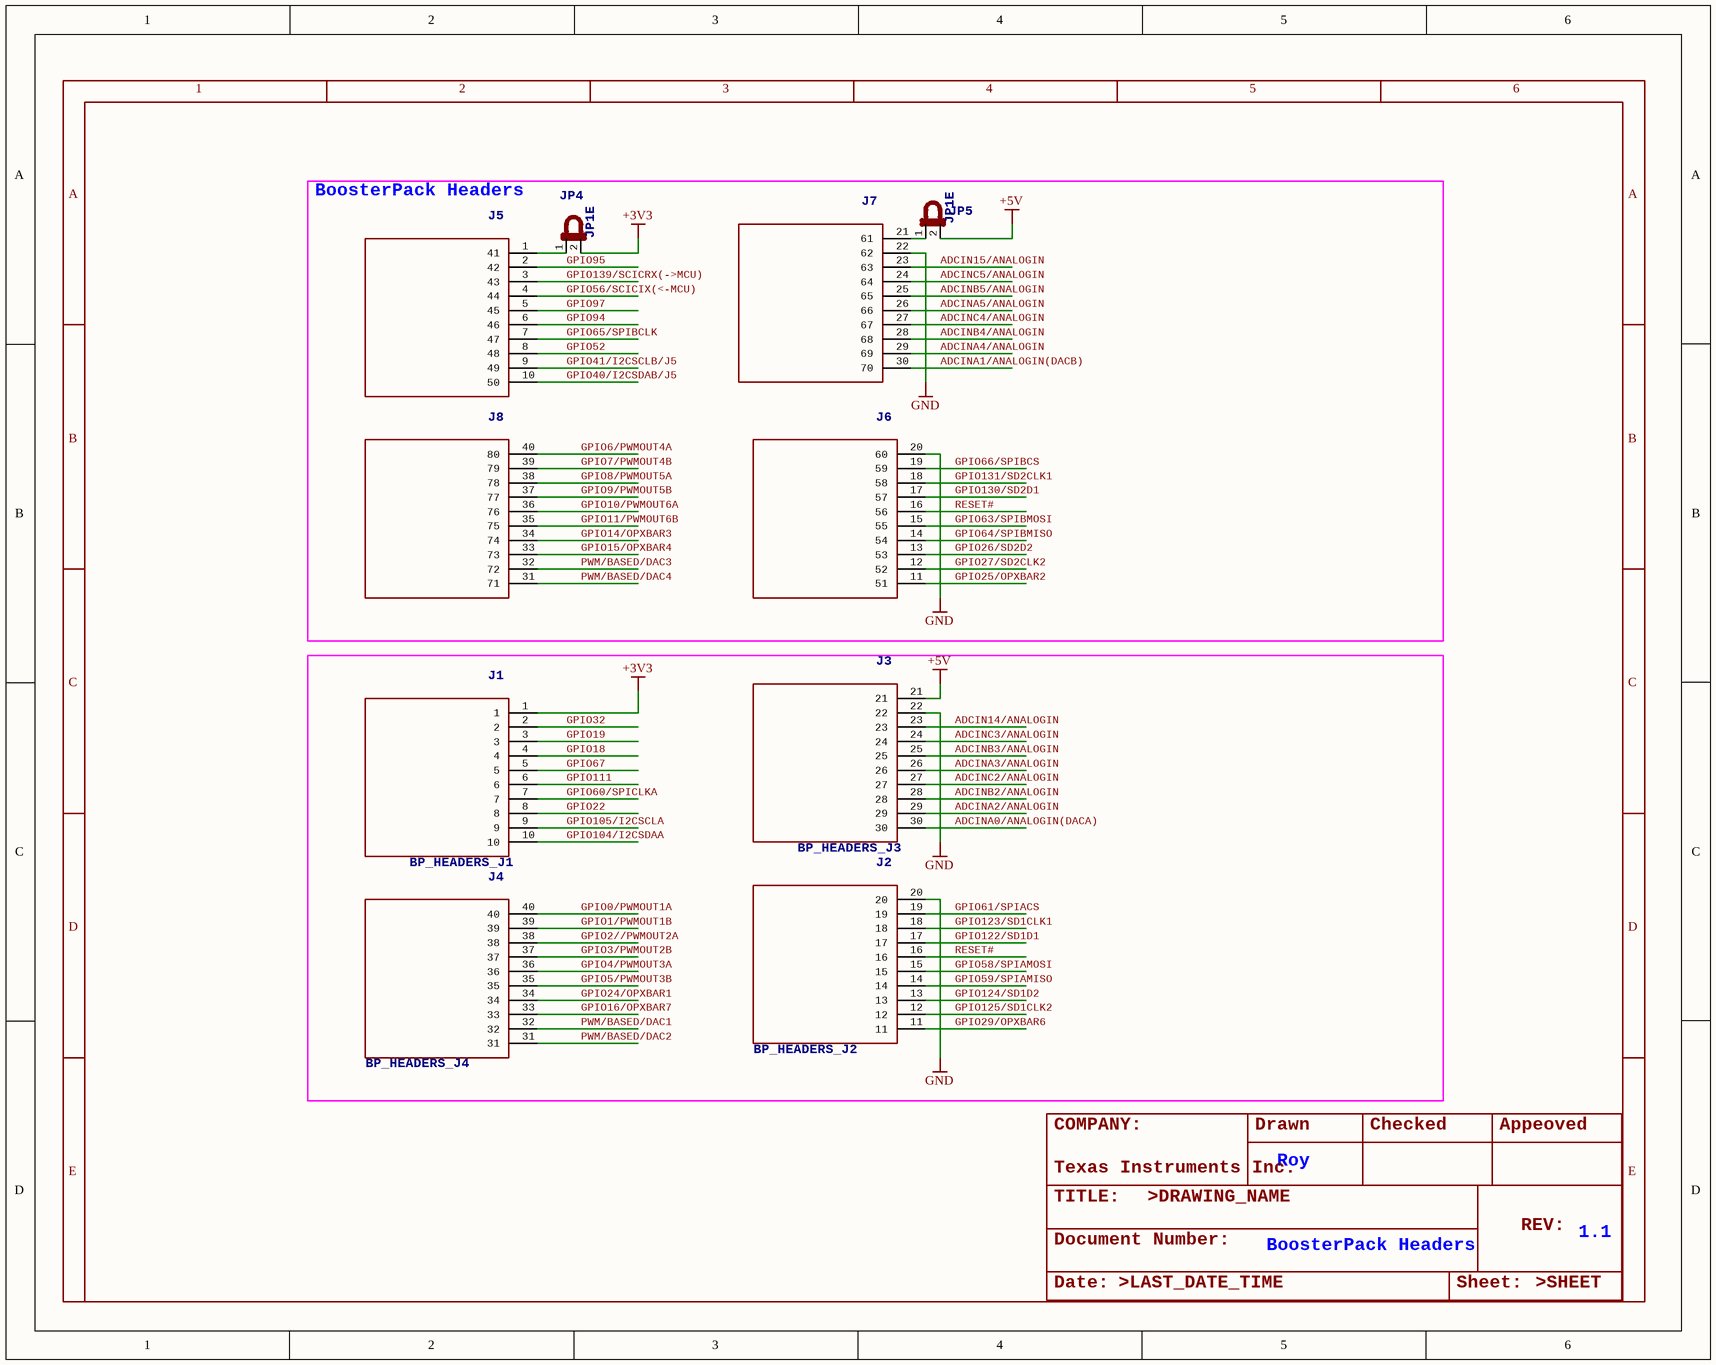
[diagram p5: LAUNCHXL-F28379D_5.SchDoc]

### Parts
J1  BP_HEADERS_J1  [J1]
J2  BP_HEADERS_J2  [J2]
J3  BP_HEADERS_J3  [J3]
J4  BP_HEADERS_J4  [J4]
J5  LAUNCHPAD_TEMPLATE_LIBRARY_BP_HEADERS_J5  [LAUNCHPAD_TEMPLATE_LIBRARY_J5]  (value not drawn)
J6  LAUNCHPAD_TEMPLATE_LIBRARY_BP_HEADERS_J6  [LAUNCHPAD_TEMPLATE_LIBRARY_J6]  (value not drawn)
J7  LAUNCHPAD_TEMPLATE_LIBRARY_BP_HEADERS_J7  [LAUNCHPAD_TEMPLATE_LIBRARY_J7]  (value not drawn)
J8  LAUNCHPAD_TEMPLATE_LIBRARY_BP_HEADERS_J8  [LAUNCHPAD_TEMPLATE_LIBRARY_J8]  (value not drawn)
JP4  JP1E  [JP1]
JP5  JP1E  [JP1]
U$12  ROY_JUMPER  [ROY_JUMPER]  (value not drawn)
U$13  ROY_JUMPER  [ROY_JUMPER]  (value not drawn)

### Blocks framed on the sheet
BoosterPack Headers: J5-J8 JP4 JP5 U$12 U$13

### Nets
+3V3: J1.1 JP4.2  [project net GPIO43/SCIARX(->MCU)]
+5V: J3.21 JP5.2
GND: J2.20 J3.22 J6.20(60) J7.22(62)
ADCIN14/ANALOGIN: J3.23
ADCIN15/ANALOGIN: J7.23(63)
ADCINA0/ANALOGIN(DACA): J3.30
ADCINA1/ANALOGIN(DACB): J7.30(70)
ADCINA2/ANALOGIN: J3.29
ADCINA3/ANALOGIN: J3.26
ADCINA4/ANALOGIN: J7.29(69)
ADCINA5/ANALOGIN: J7.26(66)
ADCINB2/ANALOGIN: J3.28
ADCINB3/ANALOGIN: J3.25
ADCINB4/ANALOGIN: J7.28(68)
ADCINB5/ANALOGIN: J7.25(65)
ADCINC2/ANALOGIN: J3.27
ADCINC3/ANALOGIN: J3.24
ADCINC4/ANALOGIN: J7.27(67)
ADCINC5/ANALOGIN: J7.24(64)
GPIO0/PWMOUT1A: J4.40
GPIO1/PWMOUT1B: J4.39
GPIO2//PWMOUT2A: J4.38
GPIO3/PWMOUT2B: J4.37
GPIO4/PWMOUT3A: J4.36
GPIO5/PWMOUT3B: J4.35
GPIO6/PWMOUT4A: J8.40(80)
GPIO7/PWMOUT4B: J8.39(79)
GPIO8/PWMOUT5A: J8.38(78)
GPIO9/PWMOUT5B: J8.37(77)
GPIO10/PWMOUT6A: J8.36(76)
GPIO11/PWMOUT6B: J8.35(75)
GPIO14/OPXBAR3: J8.34(74)
GPIO15/OPXBAR4: J8.33(73)
GPIO16/OPXBAR7: J4.33
GPIO18: J1.4
GPIO19: J1.3
GPIO22: J1.8
GPIO24/OPXBAR1: J4.34
GPIO25/OPXBAR2: J6.11(51)
GPIO26/SD2D2: J6.13(53)
GPIO27/SD2CLK2: J6.12(52)
GPIO29/OPXBAR6: J2.11
GPIO32: J1.2
GPIO40/I2CSDAB/J5: J5.10(50)
GPIO41/I2CSCLB/J5: J5.9(49)
GPIO52: J5.8(48)
GPIO56/SCICIX(<-MCU): J5.4(44)
GPIO58/SPIAMOSI: J2.15
GPIO59/SPIAMISO: J2.14
GPIO60/SPICLKA: J1.7
GPIO61/SPIACS: J2.19
GPIO63/SPIBMOSI: J6.15(55)
GPIO64/SPIBMISO: J6.14(54)
GPIO65/SPIBCLK: J5.7(47)
GPIO66/SPIBCS: J6.19(59)
GPIO67: J1.5
GPIO94: J5.6(46)
GPIO95: J5.2(42)
GPIO97: J5.5(45)
GPIO104/I2CSDAA: J1.10
GPIO105/I2CSCLA: J1.9
GPIO111: J1.6
GPIO122/SD1D1: J2.17
GPIO123/SD1CLK1: J2.18
GPIO124/SD1D2: J2.13
GPIO125/SD1CLK2: J2.12
GPIO130/SD2D1: J6.17(57)
GPIO131/SD2CLK1: J6.18(58)
GPIO139/SCICRX(->MCU): J5.3(43)
PWM/BASED/DAC1: J4.32
PWM/BASED/DAC2: J4.31
PWM/BASED/DAC3: J8.32(72)
PWM/BASED/DAC4: J8.31(71)
RESET#: J2.16 J6.16(56)
NetJ5_1: J5.1(41) JP4.1
NetJ7_21: J7.21(61) JP5.1

### Notes on the sheet
- COMPANY:
- Texas
  Instruments Inc.
- Drawn
- Roy
- Checked
- Appeoved
- TITLE:
- Document Number:
- >DRAWING_NAME
- REV:
- 1.1
- Date:
- >LAST_DATE_TIME
- BoosterPack Headers
- Sheet:
- >SHEET
- 1
- 2
- 3
- 4
- 5
- 6
- A
- B
- C
- D
- E

### Library data of the parts
JP4 JP5 = JP1E: <b>JUMPER</b>

## Sheet LAUNCHXL-F28379D_6.SchDoc
size 301 x 239 mm
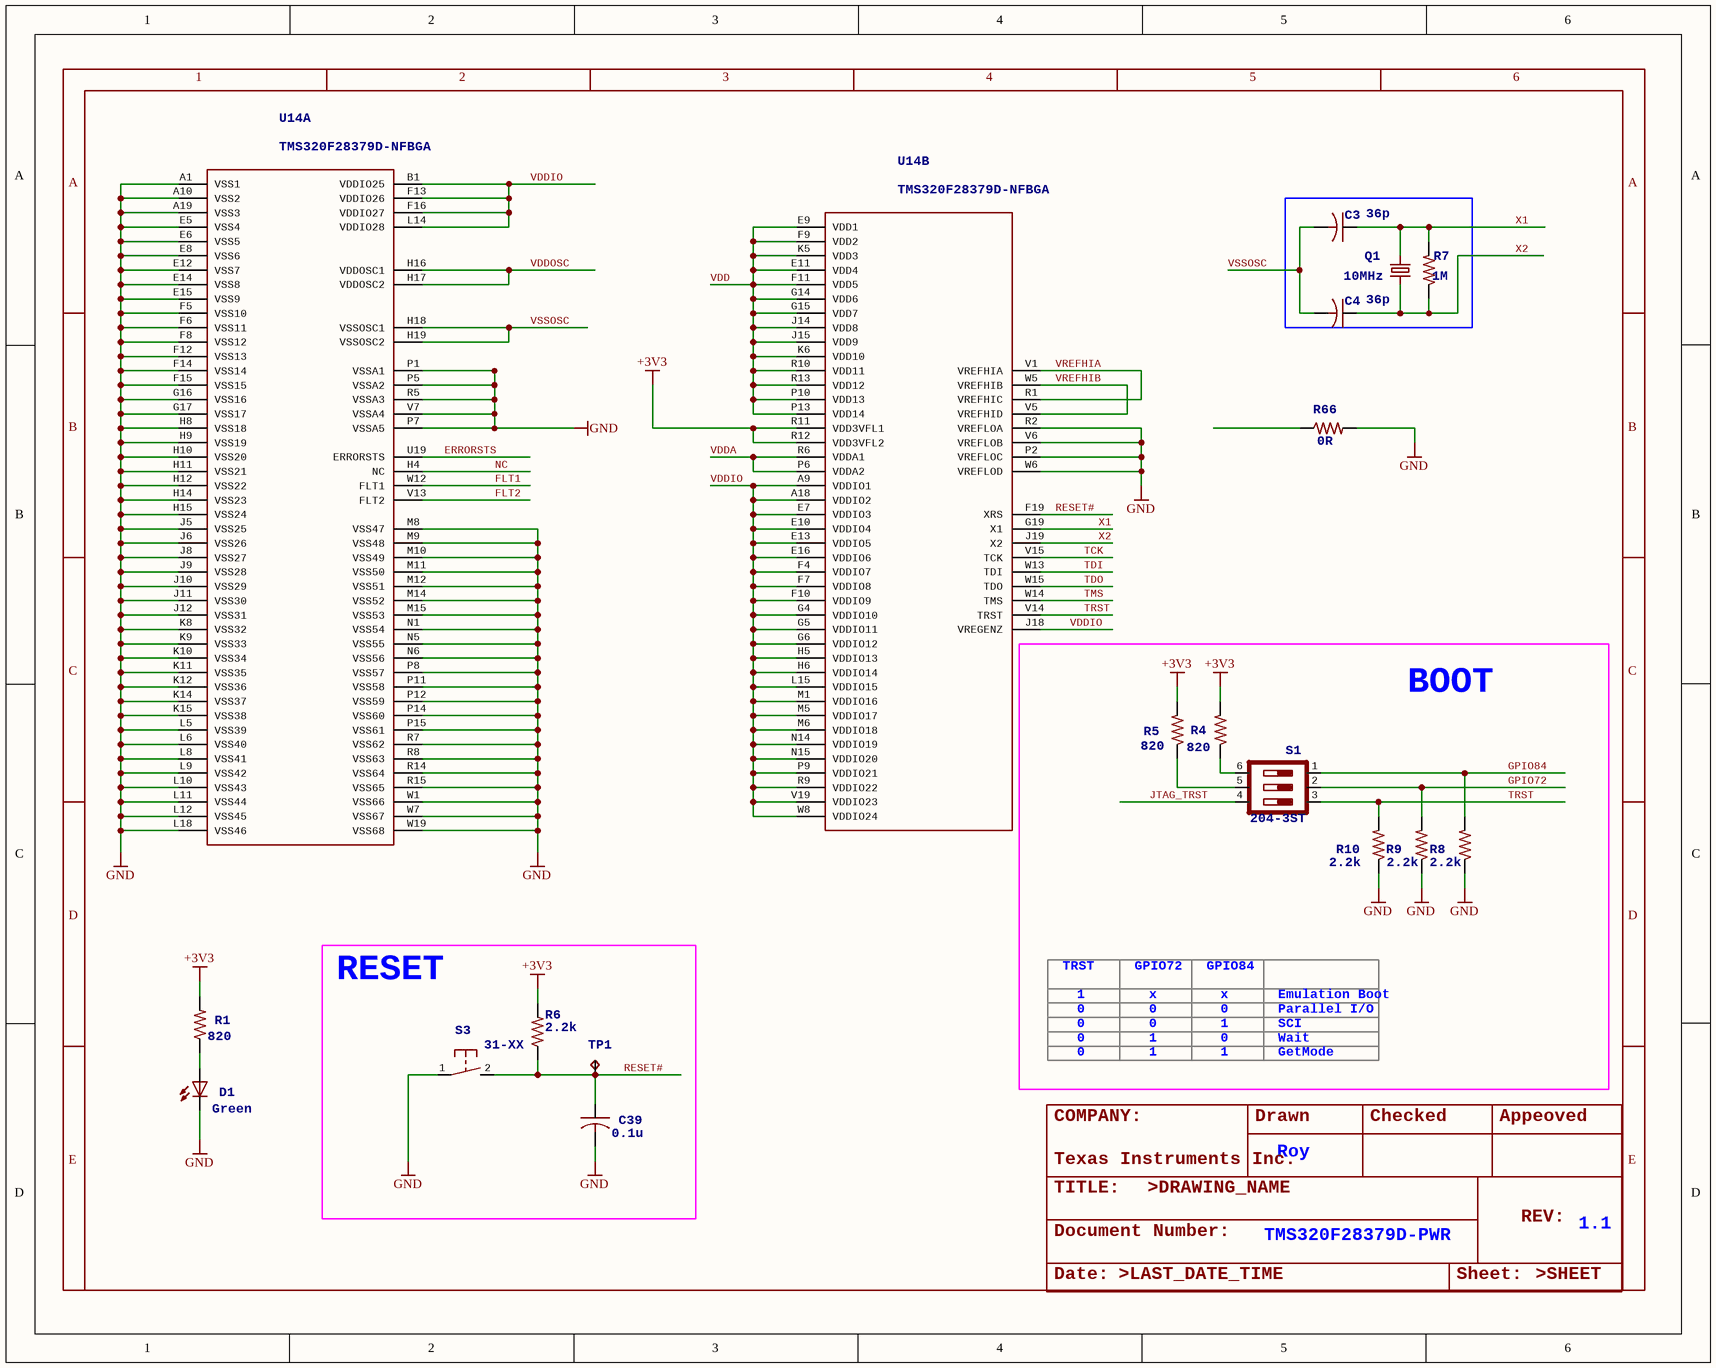
[diagram p6: LAUNCHXL-F28379D_6.SchDoc]

### Parts
C3  36p  [C0402]
C4  36p  [C0402]
C39  0.1u  [C0402]
D1  Green  [CHIP-LED0603]
Q1  10MHz  [HC49/S]
R1  820  [R0402]
R4  820  [R0402]
R5  820  [R0402]
R6  2.2k  [R0402]
R7  1M  [R0402]
R8  2.2k  [R0402]
R9  2.2k  [R0402]
R10  2.2k  [R0402]
R66  0R  [R0402]
S1  204-3ST  [CTS-219-03]
S3  31-XX  [B3F-31XX]
TP1  TESTPAD_TPB1,27  [TESTPAD_B1,27]  (value not drawn)
U14  TMS320F28379D-NFBGA  [BGA_F28079]  (parts A,B of 5)

### Blocks framed on the sheet
BOOT: R4 R5 R8-R10 S1
RESET: C39 R6 S3 TP1

### Nets
+3V3: R1.2 R4.2 R5.2 R6.2 U14.R11(VDD3VFL1) U14.R12(VDD3VFL2)  [project net GPIO43/SCIARX(->MCU)]
GND: C39.2 D1.C R8.1 R9.1 R10.1 R66.2 S3.1(P) U14.A1(VSS1) U14.A10(VSS2) U14.A19(VSS3) U14.E5(VSS4) U14.E6(VSS5) U14.E8(VSS6) U14.E12(VSS7) U14.E14(VSS8) U14.E15(VSS9) U14.F5(VSS10) U14.F6(VSS11) U14.F8(VSS12) U14.F12(VSS13) U14.F14(VSS14) U14.F15(VSS15) U14.G16(VSS16) U14.G17(VSS17) U14.H8(VSS18) U14.H9(VSS19) U14.H10(VSS20) U14.H11(VSS21) U14.H12(VSS22) U14.H14(VSS23) U14.H15(VSS24) U14.J5(VSS25) U14.J6(VSS26) U14.J8(VSS27) U14.J9(VSS28) U14.J10(VSS29) U14.J11(VSS30) U14.J12(VSS31) U14.K8(VSS32) U14.K9(VSS33) U14.K10(VSS34) U14.K11(VSS35) U14.K12(VSS36) U14.K14(VSS37) U14.K15(VSS38) U14.L5(VSS39) U14.L6(VSS40) U14.L8(VSS41) U14.L9(VSS42) U14.L10(VSS43) U14.L11(VSS44) U14.L12(VSS45) U14.L18(VSS46) U14.M8(VSS47) U14.M9(VSS48) U14.M10(VSS49) U14.M11(VSS50) U14.M12(VSS51) U14.M14(VSS52) U14.M15(VSS53) U14.N1(VSS54) U14.N5(VSS55) U14.N6(VSS56) U14.P1(VSSA1) U14.P2(VREFLOC) U14.P5(VSSA2) U14.P7(VSSA5) U14.P8(VSS57) U14.P11(VSS58) U14.P12(VSS59) U14.P14(VSS60) U14.P15(VSS61) U14.R2(VREFLOA) U14.R5(VSSA3) U14.R7(VSS62) U14.R8(VSS63) U14.R14(VSS64) U14.R15(VSS65) U14.V6(VREFLOB) U14.V7(VSSA4) U14.W1(VSS66) U14.W6(VREFLOD) U14.W7(VSS67) U14.W19(VSS68)
ERRORSTS: U14.U19(ERRORSTS)
FLT1: U14.W12(FLT1)
FLT2: U14.V13(FLT2)
GPIO72: R9.2 S1.2
GPIO84: R8.2 S1.1
JTAG_TRST: S1.4
NC: U14.H4(NC)
RESET#: C39.1 R6.1 S3.2(S) TP1.TP U14.F19(XRS)
TCK: U14.V15(TCK)
TDI: U14.W13(TDI)
TDO: U14.W15(TDO)
TMS: U14.W14(TMS)
TRST: R10.2 S1.3 U14.V14(TRST)
VDD: U14.E9(VDD1) U14.E11(VDD4) U14.F9(VDD2) U14.F11(VDD5) U14.G14(VDD6) U14.G15(VDD7) U14.J14(VDD8) U14.J15(VDD9) U14.K5(VDD3) U14.K6(VDD10) U14.P10(VDD13) U14.P13(VDD14) U14.R10(VDD11) U14.R13(VDD12)
VDDA: U14.P6(VDDA2) U14.R6(VDDA1)
VDDIO: U14.A9(VDDIO1) U14.A18(VDDIO2) U14.B1(VDDIO25) U14.E7(VDDIO3) U14.E10(VDDIO4) U14.E13(VDDIO5) U14.E16(VDDIO6) U14.F4(VDDIO7) U14.F7(VDDIO8) U14.F10(VDDIO9) U14.F13(VDDIO26) U14.F16(VDDIO27) U14.G4(VDDIO10) U14.G5(VDDIO11) U14.G6(VDDIO12) U14.H5(VDDIO13) U14.H6(VDDIO14) U14.J18(VREGENZ) U14.L14(VDDIO28) U14.L15(VDDIO15) U14.M1(VDDIO16) U14.M5(VDDIO17) U14.M6(VDDIO18) U14.N14(VDDIO19) U14.N15(VDDIO20) U14.P9(VDDIO21) U14.R9(VDDIO22) U14.V19(VDDIO23) U14.W8(VDDIO24)
VDDOSC: U14.H16(VDDOSC1) U14.H17(VDDOSC2)
VREFHIA: U14.R1(VREFHIC) U14.V1(VREFHIA)
VREFHIB: U14.V5(VREFHID) U14.W5(VREFHIB)
VSSOSC: C3.2 C4.2 U14.H18(VSSOSC1) U14.H19(VSSOSC2)
X1: C3.1 Q1.2 R7.2 U14.G19(X1)
X2: C4.1 Q1.1 R7.1 U14.J19(X2)
NetD1_A: D1.A R1.1
NetR4_1: R4.1 S1.6
NetR5_1: R5.1 S1.5

Not connected (* = marked no-connect by the designer): R66 1

### Notes on the sheet
- TRST
- 1
- 0
- GPIO72
- x
- GPIO84
- Emulation Boot
- Parallel I/O
- SCI
- Wait
- GetMode
- COMPANY:
- Texas
  Instruments Inc.
- Drawn
- Roy
- Checked
- Appeoved
- TITLE:
- Document Number:
- >DRAWING_NAME
- TMS320F28379D-PWR
- REV:
- 1.1
- Date:
- >LAST_DATE_TIME
- Sheet:
- >SHEET
- 2
- 3
- 4
- 5
- 6
- A
- B
- C
- D
- E

### Library data of the parts
C3 C4 C39 = C-USC0402: <B>CAPACITOR</B>, American symbol
D1 = LEDCHIP-LED0603: as D4 on sheet LAUNCHXL-F28379D_1
Q1 = CRYSTALHC49S: <b>CRYSTAL</b>
R1 R4-R10 R66 = R-US_R0402: <B>RESISTOR</B>, American symbol
S1 = 219-03*: <b>Surface Mount DIP Switch Series 219 SMT</b><p> / CTS Electronic Components<br> / Sourc: www.ctscorp.com
S3 = 31-XX: <b>OMRON SWITCH</b>
TP1 = TESTPAD_TPB1,27: <b>Test pad</b>

## Sheet LAUNCHXL-F28379D_7.SchDoc
size 301 x 239 mm
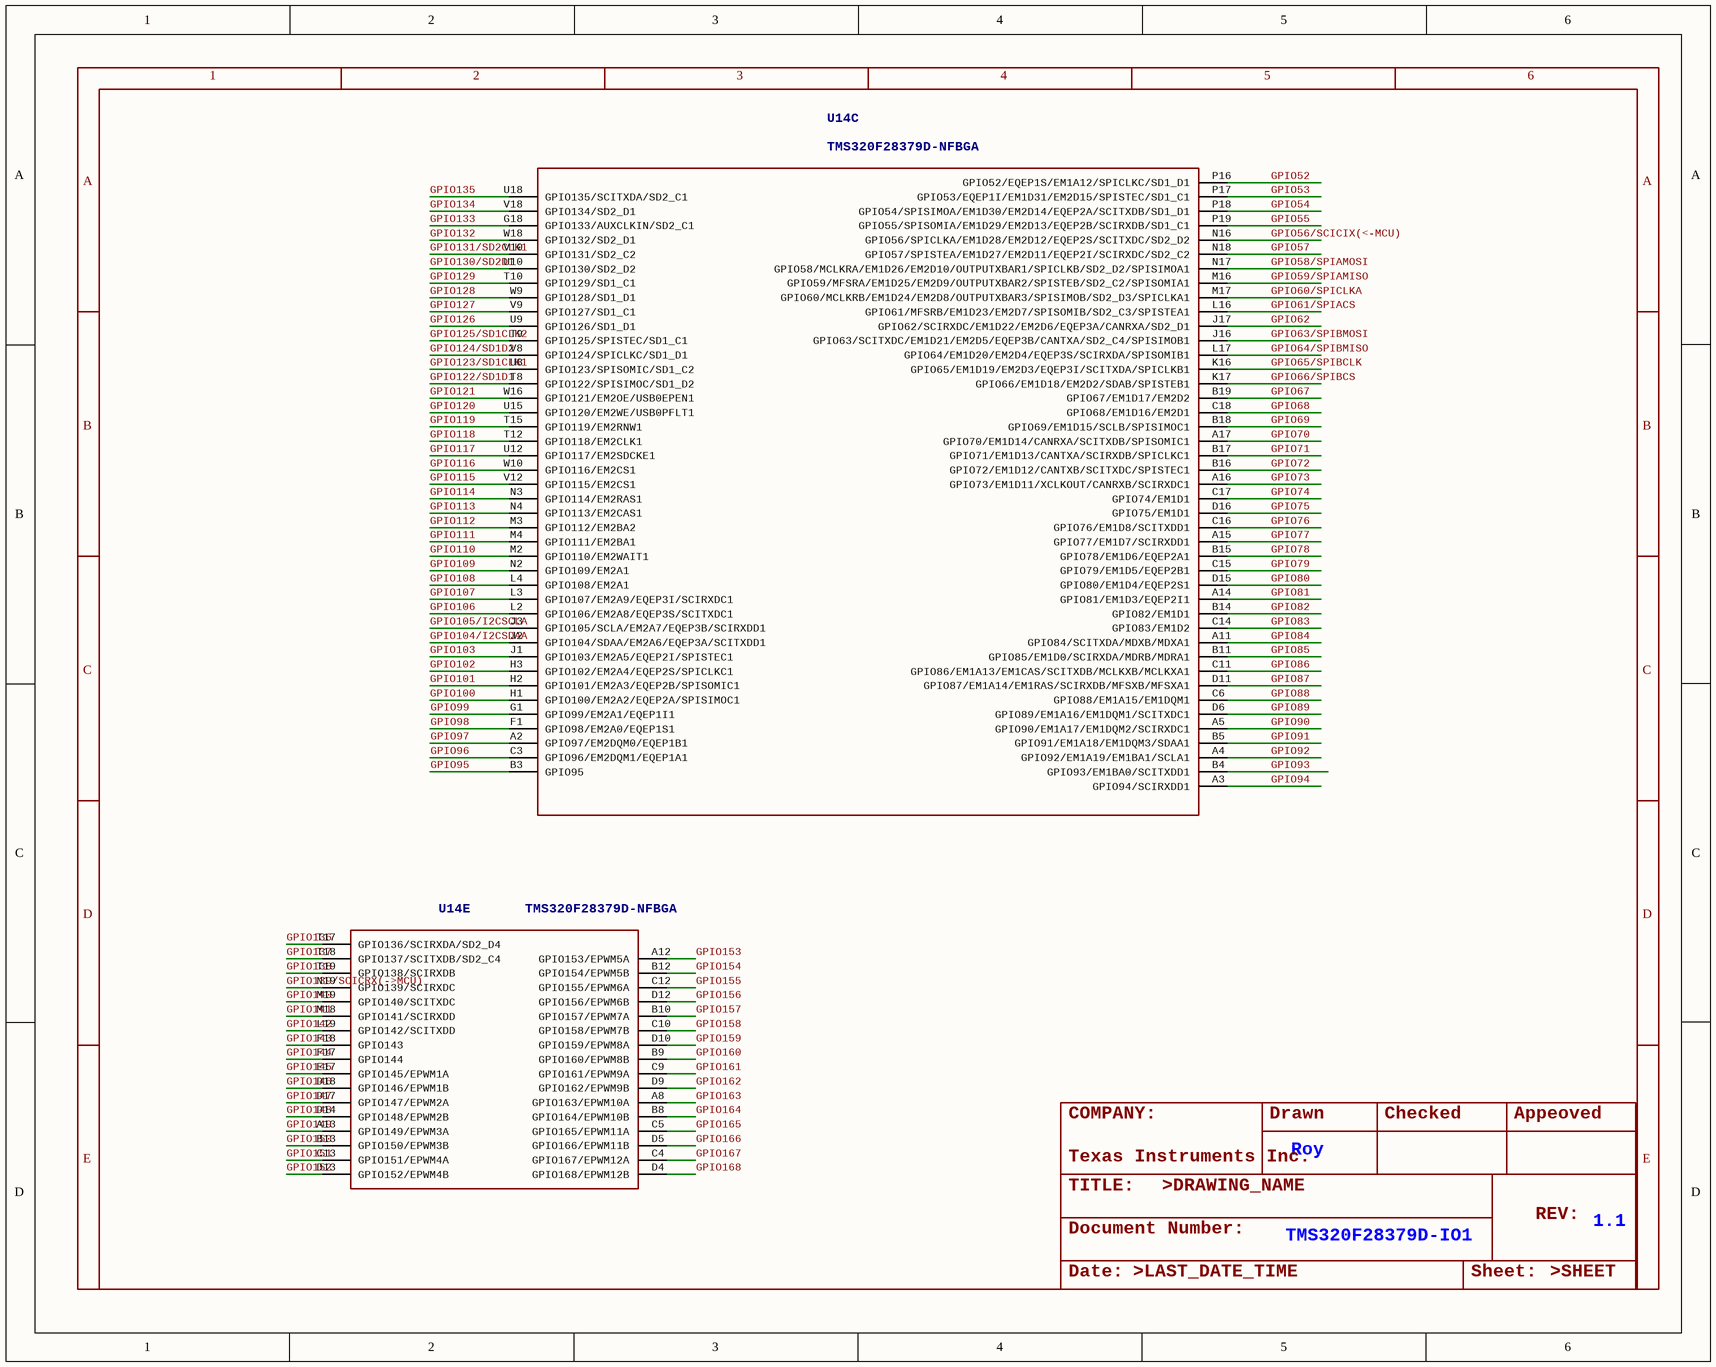
[diagram p7: LAUNCHXL-F28379D_7.SchDoc]

### Parts
U14  TMS320F28379D-NFBGA  [BGA_F28079]  (parts C,E of 5)

### Nets
GPIO52: U14.P16(GPIO52/EQEP1S/EM1A12/SPICLKC/SD1_D1)
GPIO53: U14.P17(GPIO53/EQEP1I/EM1D31/EM2D15/SPISTEC/SD1_C1)
GPIO54: U14.P18(GPIO54/SPISIMOA/EM1D30/EM2D14/EQEP2A/SCITXDB/SD1_D1)
GPIO55: U14.P19(GPIO55/SPISOMIA/EM1D29/EM2D13/EQEP2B/SCIRXDB/SD1_C1)
GPIO56/SCICIX(<-MCU): U14.N16(GPIO56/SPICLKA/EM1D28/EM2D12/EQEP2S/SCITXDC/SD2_D2)
GPIO57: U14.N18(GPIO57/SPISTEA/EM1D27/EM2D11/EQEP2I/SCIRXDC/SD2_C2)
GPIO58/SPIAMOSI: U14.N17(GPIO58/MCLKRA/EM1D26/EM2D10/OUTPUTXBAR1/SPICLKB/SD2_D2/SPISIMOA1)
GPIO59/SPIAMISO: U14.M16(GPIO59/MFSRA/EM1D25/EM2D9/OUTPUTXBAR2/SPISTEB/SD2_C2/SPISOMIA1)
GPIO60/SPICLKA: U14.M17(GPIO60/MCLKRB/EM1D24/EM2D8/OUTPUTXBAR3/SPISIMOB/SD2_D3/SPICLKA1)
GPIO61/SPIACS: U14.L16(GPIO61/MFSRB/EM1D23/EM2D7/SPISOMIB/SD2_C3/SPISTEA1)
GPIO62: U14.J17(GPIO62/SCIRXDC/EM1D22/EM2D6/EQEP3A/CANRXA/SD2_D1)
GPIO63/SPIBMOSI: U14.J16(GPIO63/SCITXDC/EM1D21/EM2D5/EQEP3B/CANTXA/SD2_C4/SPISIMOB1)
GPIO64/SPIBMISO: U14.L17(GPIO64/EM1D20/EM2D4/EQEP3S/SCIRXDA/SPISOMIB1)
GPIO65/SPIBCLK: U14.K16(GPIO65/EM1D19/EM2D3/EQEP3I/SCITXDA/SPICLKB1)
GPIO66/SPIBCS: U14.K17(GPIO66/EM1D18/EM2D2/SDAB/SPISTEB1)
GPIO67: U14.B19(GPIO67/EM1D17/EM2D2)
GPIO68: U14.C18(GPIO68/EM1D16/EM2D1)
GPIO69: U14.B18(GPIO69/EM1D15/SCLB/SPISIMOC1)
GPIO70: U14.A17(GPIO70/EM1D14/CANRXA/SCITXDB/SPISOMIC1)
GPIO71: U14.B17(GPIO71/EM1D13/CANTXA/SCIRXDB/SPICLKC1)
GPIO72: U14.B16(GPIO72/EM1D12/CANTXB/SCITXDC/SPISTEC1)
GPIO73: U14.A16(GPIO73/EM1D11/XCLKOUT/CANRXB/SCIRXDC1)
GPIO74: U14.C17(GPIO74/EM1D1)
GPIO75: U14.D16(GPIO75/EM1D1)
GPIO76: U14.C16(GPIO76/EM1D8/SCITXDD1)
GPIO77: U14.A15(GPIO77/EM1D7/SCIRXDD1)
GPIO78: U14.B15(GPIO78/EM1D6/EQEP2A1)
GPIO79: U14.C15(GPIO79/EM1D5/EQEP2B1)
GPIO80: U14.D15(GPIO80/EM1D4/EQEP2S1)
GPIO81: U14.A14(GPIO81/EM1D3/EQEP2I1)
GPIO82: U14.B14(GPIO82/EM1D1)
GPIO83: U14.C14(GPIO83/EM1D2)
GPIO84: U14.A11(GPIO84/SCITXDA/MDXB/MDXA1)
GPIO85: U14.B11(GPIO85/EM1D0/SCIRXDA/MDRB/MDRA1)
GPIO86: U14.C11(GPIO86/EM1A13/EM1CAS/SCITXDB/MCLKXB/MCLKXA1)
GPIO87: U14.D11(GPIO87/EM1A14/EM1RAS/SCIRXDB/MFSXB/MFSXA1)
GPIO88: U14.C6(GPIO88/EM1A15/EM1DQM1)
GPIO89: U14.D6(GPIO89/EM1A16/EM1DQM1/SCITXDC1)
GPIO90: U14.A5(GPIO90/EM1A17/EM1DQM2/SCIRXDC1)
GPIO91: U14.B5(GPIO91/EM1A18/EM1DQM3/SDAA1)
GPIO92: U14.A4(GPIO92/EM1A19/EM1BA1/SCLA1)
GPIO93: U14.B4(GPIO93/EM1BA0/SCITXDD1)
GPIO94: U14.A3(GPIO94/SCIRXDD1)
GPIO95: U14.B3(GPIO95)
GPIO96: U14.C3(GPIO96/EM2DQM1/EQEP1A1)
GPIO97: U14.A2(GPIO97/EM2DQM0/EQEP1B1)
GPIO98: U14.F1(GPIO98/EM2A0/EQEP1S1)
GPIO99: U14.G1(GPIO99/EM2A1/EQEP1I1)
GPIO100: U14.H1(GPIO100/EM2A2/EQEP2A/SPISIMOC1)
GPIO101: U14.H2(GPIO101/EM2A3/EQEP2B/SPISOMIC1)
GPIO102: U14.H3(GPIO102/EM2A4/EQEP2S/SPICLKC1)
GPIO103: U14.J1(GPIO103/EM2A5/EQEP2I/SPISTEC1)
GPIO104/I2CSDAA: U14.J2(GPIO104/SDAA/EM2A6/EQEP3A/SCITXDD1)
GPIO105/I2CSCLA: U14.J3(GPIO105/SCLA/EM2A7/EQEP3B/SCIRXDD1)
GPIO106: U14.L2(GPIO106/EM2A8/EQEP3S/SCITXDC1)
GPIO107: U14.L3(GPIO107/EM2A9/EQEP3I/SCIRXDC1)
GPIO108: U14.L4(GPIO108/EM2A1)
GPIO109: U14.N2(GPIO109/EM2A1)
GPIO110: U14.M2(GPIO110/EM2WAIT1)
GPIO111: U14.M4(GPIO111/EM2BA1)
GPIO112: U14.M3(GPIO112/EM2BA2)
GPIO113: U14.N4(GPIO113/EM2CAS1)
GPIO114: U14.N3(GPIO114/EM2RAS1)
GPIO115: U14.V12(GPIO115/EM2CS1)
GPIO116: U14.W10(GPIO116/EM2CS1)
GPIO117: U14.U12(GPIO117/EM2SDCKE1)
GPIO118: U14.T12(GPIO118/EM2CLK1)
GPIO119: U14.T15(GPIO119/EM2RNW1)
GPIO120: U14.U15(GPIO120/EM2WE/USB0PFLT1)
GPIO121: U14.W16(GPIO121/EM2OE/USB0EPEN1)
GPIO122/SD1D1: U14.T8(GPIO122/SPISIMOC/SD1_D2)
GPIO123/SD1CLK1: U14.U8(GPIO123/SPISOMIC/SD1_C2)
GPIO124/SD1D2: U14.V8(GPIO124/SPICLKC/SD1_D1)
GPIO125/SD1CLK2: U14.T9(GPIO125/SPISTEC/SD1_C1)
GPIO126: U14.U9(GPIO126/SD1_D1)
GPIO127: U14.V9(GPIO127/SD1_C1)
GPIO128: U14.W9(GPIO128/SD1_D1)
GPIO129: U14.T10(GPIO129/SD1_C1)
GPIO130/SD2D1: U14.U10(GPIO130/SD2_D2)
GPIO131/SD2CLK1: U14.V10(GPIO131/SD2_C2)
GPIO132: U14.W18(GPIO132/SD2_D1)
GPIO133: U14.G18(GPIO133/AUXCLKIN/SD2_C1)
GPIO134: U14.V18(GPIO134/SD2_D1)
GPIO135: U14.U18(GPIO135/SCITXDA/SD2_C1)
GPIO136: U14.T17(GPIO136/SCIRXDA/SD2_D4)
GPIO137: U14.T18(GPIO137/SCITXDB/SD2_C4)
GPIO138: U14.T19(GPIO138/SCIRXDB)
GPIO139/SCICRX(->MCU): U14.N19(GPIO139/SCIRXDC)
GPIO140: U14.M19(GPIO140/SCITXDC)
GPIO141: U14.M18(GPIO141/SCIRXDD)
GPIO142: U14.L19(GPIO142/SCITXDD)
GPIO143: U14.F18(GPIO143)
GPIO144: U14.F17(GPIO144)
GPIO145: U14.E17(GPIO145/EPWM1A)
GPIO146: U14.D18(GPIO146/EPWM1B)
GPIO147: U14.D17(GPIO147/EPWM2A)
GPIO148: U14.D14(GPIO148/EPWM2B)
GPIO149: U14.A13(GPIO149/EPWM3A)
GPIO150: U14.B13(GPIO150/EPWM3B)
GPIO151: U14.C13(GPIO151/EPWM4A)
GPIO152: U14.D13(GPIO152/EPWM4B)
GPIO153: U14.A12(GPIO153/EPWM5A)
GPIO154: U14.B12(GPIO154/EPWM5B)
GPIO155: U14.C12(GPIO155/EPWM6A)
GPIO156: U14.D12(GPIO156/EPWM6B)
GPIO157: U14.B10(GPIO157/EPWM7A)
GPIO158: U14.C10(GPIO158/EPWM7B)
GPIO159: U14.D10(GPIO159/EPWM8A)
GPIO160: U14.B9(GPIO160/EPWM8B)
GPIO161: U14.C9(GPIO161/EPWM9A)
GPIO162: U14.D9(GPIO162/EPWM9B)
GPIO163: U14.A8(GPIO163/EPWM10A)
GPIO164: U14.B8(GPIO164/EPWM10B)
GPIO165: U14.C5(GPIO165/EPWM11A)
GPIO166: U14.D5(GPIO166/EPWM11B)
GPIO167: U14.C4(GPIO167/EPWM12A)
GPIO168: U14.D4(GPIO168/EPWM12B)

### Notes on the sheet
- COMPANY:
- Texas
  Instruments Inc.
- Drawn
- Roy
- Checked
- Appeoved
- TITLE:
- Document Number:
- >DRAWING_NAME
- TMS320F28379D-IO1
- REV:
- 1.1
- Date:
- >LAST_DATE_TIME
- Sheet:
- >SHEET
- 1
- 2
- 3
- 4
- 5
- 6
- A
- B
- C
- D
- E

## Sheet LAUNCHXL-F28379D_8.SchDoc
size 301 x 239 mm
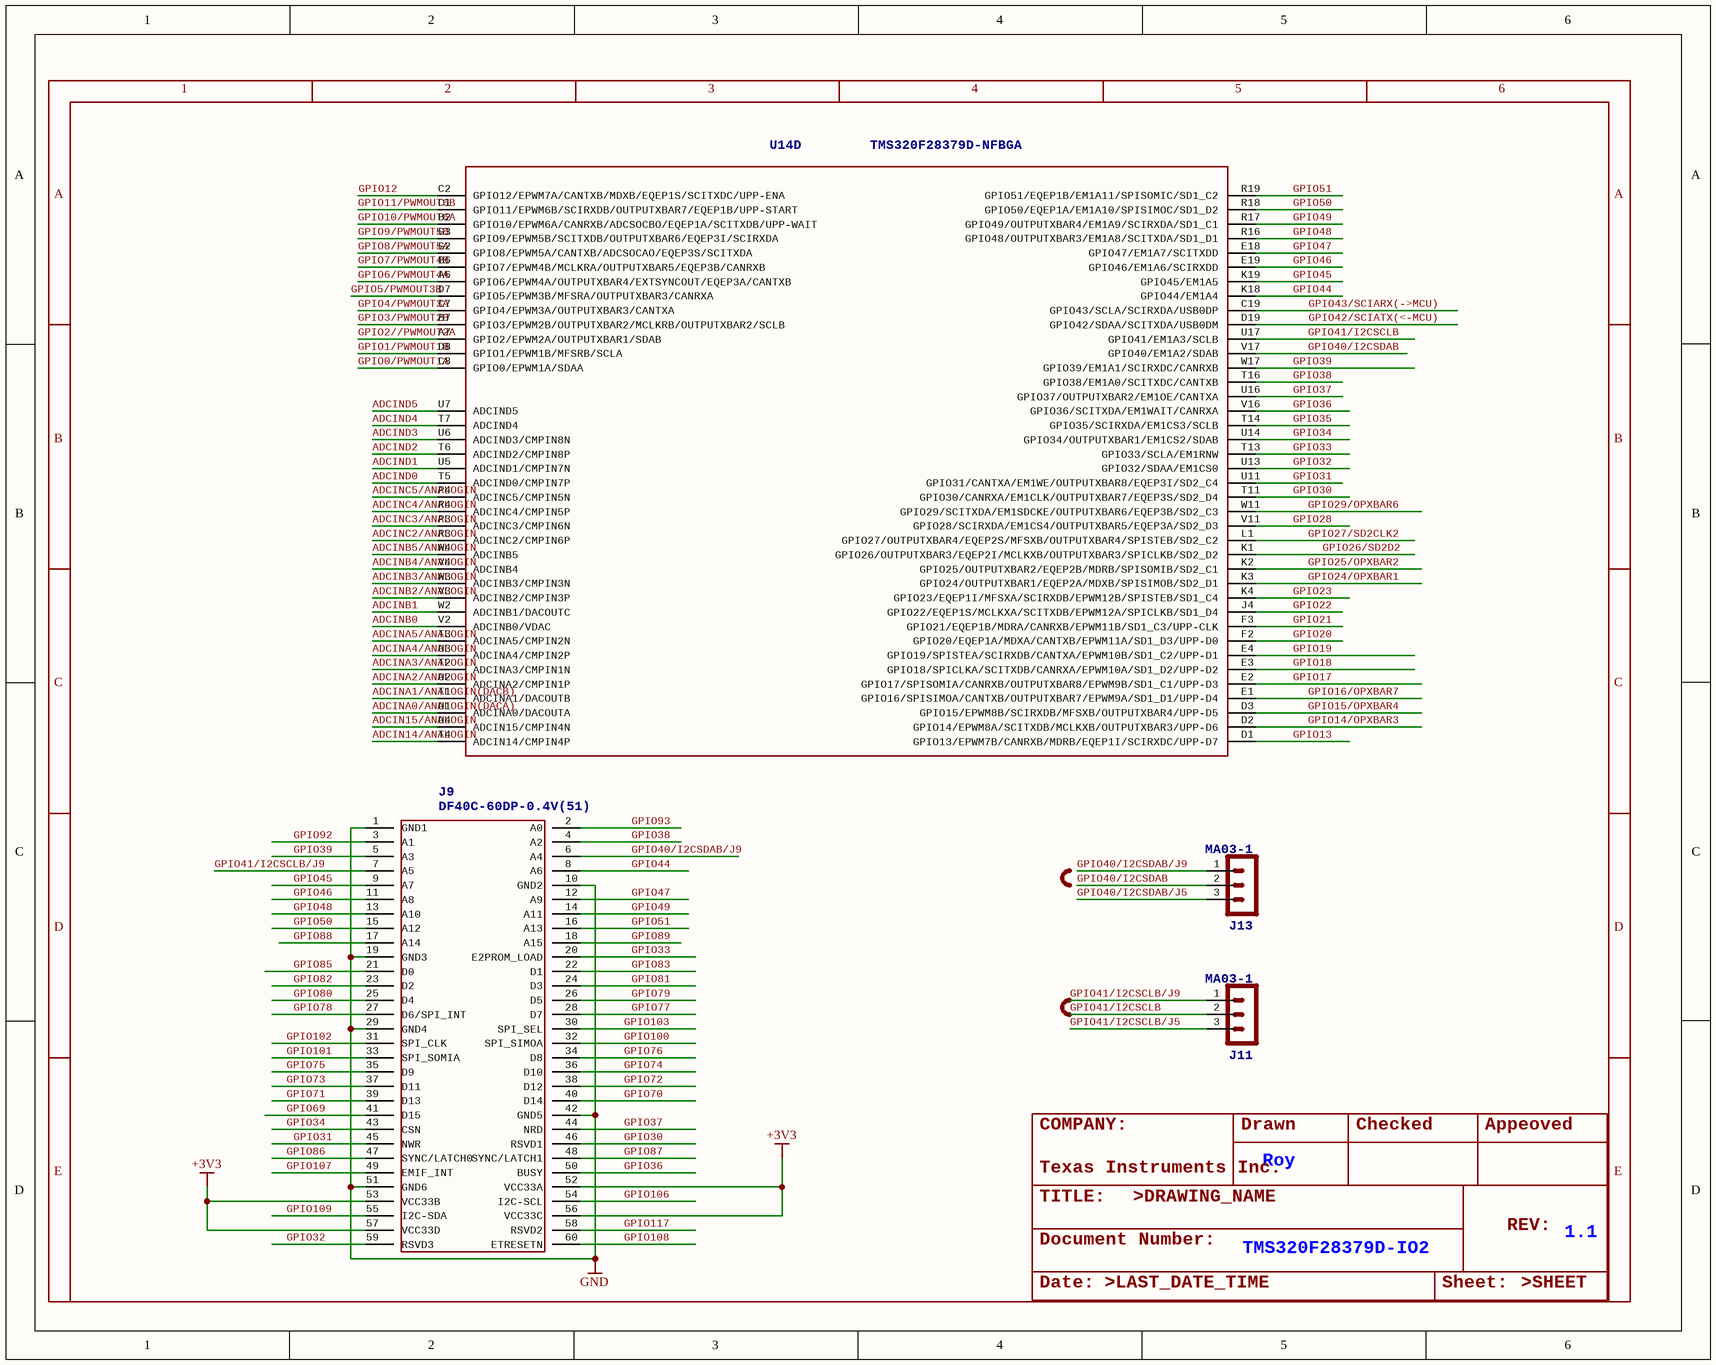
[diagram p8: LAUNCHXL-F28379D_8.SchDoc]

### Parts
J9  DF40C-60DP-0.4V(51)  [DF40C-60DP-0.4V(51)]
J11  MA03-1  [MA03-1]
J13  MA03-1  [MA03-1]
U14  TMS320F28379D-NFBGA  [BGA_F28079]  (part D of 5)
U$14  ROY_JUMPER  [ROY_JUMPER]  (value not drawn)
U$17  ROY_JUMPER  [ROY_JUMPER]  (value not drawn)

### Nets
GND: J9.1(GND1) J9.10(GND2) J9.19(GND3) J9.29(GND4) J9.42(GND5) J9.51(GND6)
GPIO43/SCIARX(->MCU): J9.52(VCC33A) J9.53(VCC33B) J9.56(VCC33C) J9.57(VCC33D) U14.C19(GPIO43/SCLA/SCIRXDA/USB0DP)  [also labelled +3V3]
ADCIN14/ANALOGIN: U14.T4(ADCIN14/CMPIN4P)
ADCIN15/ANALOGIN: U14.U4(ADCIN15/CMPIN4N)
ADCINA0/ANALOGIN(DACA): U14.U1(ADCINA0/DACOUTA)
ADCINA1/ANALOGIN(DACB): U14.T1(ADCINA1/DACOUTB)
ADCINA2/ANALOGIN: U14.U2(ADCINA2/CMPIN1P)
ADCINA3/ANALOGIN: U14.T2(ADCINA3/CMPIN1N)
ADCINA4/ANALOGIN: U14.U3(ADCINA4/CMPIN2P)
ADCINA5/ANALOGIN: U14.T3(ADCINA5/CMPIN2N)
ADCINB0: U14.V2(ADCINB0/VDAC)
ADCINB1: U14.W2(ADCINB1/DACOUTC)
ADCINB2/ANALOGIN: U14.V3(ADCINB2/CMPIN3P)
ADCINB3/ANALOGIN: U14.W3(ADCINB3/CMPIN3N)
ADCINB4/ANALOGIN: U14.V4(ADCINB4)
ADCINB5/ANALOGIN: U14.W4(ADCINB5)
ADCINC2/ANALOGIN: U14.R3(ADCINC2/CMPIN6P)
ADCINC3/ANALOGIN: U14.P3(ADCINC3/CMPIN6N)
ADCINC4/ANALOGIN: U14.R4(ADCINC4/CMPIN5P)
ADCINC5/ANALOGIN: U14.P4(ADCINC5/CMPIN5N)
ADCIND0: U14.T5(ADCIND0/CMPIN7P)
ADCIND1: U14.U5(ADCIND1/CMPIN7N)
ADCIND2: U14.T6(ADCIND2/CMPIN8P)
ADCIND3: U14.U6(ADCIND3/CMPIN8N)
ADCIND4: U14.T7(ADCIND4)
ADCIND5: U14.U7(ADCIND5)
GPIO0/PWMOUT1A: U14.C8(GPIO0/EPWM1A/SDAA)
GPIO1/PWMOUT1B: U14.D8(GPIO1/EPWM1B/MFSRB/SCLA)
GPIO2//PWMOUT2A: U14.A7(GPIO2/EPWM2A/OUTPUTXBAR1/SDAB)
GPIO3/PWMOUT2B: U14.B7(GPIO3/EPWM2B/OUTPUTXBAR2/MCLKRB/OUTPUTXBAR2/SCLB)
GPIO4/PWMOUT3A: U14.C7(GPIO4/EPWM3A/OUTPUTXBAR3/CANTXA)
GPIO5/PWMOUT3B: U14.D7(GPIO5/EPWM3B/MFSRA/OUTPUTXBAR3/CANRXA)
GPIO6/PWMOUT4A: U14.A6(GPIO6/EPWM4A/OUTPUTXBAR4/EXTSYNCOUT/EQEP3A/CANTXB)
GPIO7/PWMOUT4B: U14.B6(GPIO7/EPWM4B/MCLKRA/OUTPUTXBAR5/EQEP3B/CANRXB)
GPIO8/PWMOUT5A: U14.G2(GPIO8/EPWM5A/CANTXB/ADCSOCAO/EQEP3S/SCITXDA)
GPIO9/PWMOUT5B: U14.G3(GPIO9/EPWM5B/SCITXDB/OUTPUTXBAR6/EQEP3I/SCIRXDA)
GPIO10/PWMOUT6A: U14.B2(GPIO10/EPWM6A/CANRXB/ADCSOCBO/EQEP1A/SCITXDB/UPP-WAIT)
GPIO11/PWMOUT6B: U14.C1(GPIO11/EPWM6B/SCIRXDB/OUTPUTXBAR7/EQEP1B/UPP-START)
GPIO12: U14.C2(GPIO12/EPWM7A/CANTXB/MDXB/EQEP1S/SCITXDC/UPP-ENA)
GPIO13: U14.D1(GPIO13/EPWM7B/CANRXB/MDRB/EQEP1I/SCIRXDC/UPP-D7)
GPIO14/OPXBAR3: U14.D2(GPIO14/EPWM8A/SCITXDB/MCLKXB/OUTPUTXBAR3/UPP-D6)
GPIO15/OPXBAR4: U14.D3(GPIO15/EPWM8B/SCIRXDB/MFSXB/OUTPUTXBAR4/UPP-D5)
GPIO16/OPXBAR7: U14.E1(GPIO16/SPISIMOA/CANTXB/OUTPUTXBAR7/EPWM9A/SD1_D1/UPP-D4)
GPIO17: U14.E2(GPIO17/SPISOMIA/CANRXB/OUTPUTXBAR8/EPWM9B/SD1_C1/UPP-D3)
GPIO18: U14.E3(GPIO18/SPICLKA/SCITXDB/CANRXA/EPWM10A/SD1_D2/UPP-D2)
GPIO19: U14.E4(GPIO19/SPISTEA/SCIRXDB/CANTXA/EPWM10B/SD1_C2/UPP-D1)
GPIO20: U14.F2(GPIO20/EQEP1A/MDXA/CANTXB/EPWM11A/SD1_D3/UPP-D0)
GPIO21: U14.F3(GPIO21/EQEP1B/MDRA/CANRXB/EPWM11B/SD1_C3/UPP-CLK)
GPIO22: U14.J4(GPIO22/EQEP1S/MCLKXA/SCITXDB/EPWM12A/SPICLKB/SD1_D4)
GPIO23: U14.K4(GPIO23/EQEP1I/MFSXA/SCIRXDB/EPWM12B/SPISTEB/SD1_C4)
GPIO24/OPXBAR1: U14.K3(GPIO24/OUTPUTXBAR1/EQEP2A/MDXB/SPISIMOB/SD2_D1)
GPIO25/OPXBAR2: U14.K2(GPIO25/OUTPUTXBAR2/EQEP2B/MDRB/SPISOMIB/SD2_C1)
GPIO26/SD2D2: U14.K1(GPIO26/OUTPUTXBAR3/EQEP2I/MCLKXB/OUTPUTXBAR3/SPICLKB/SD2_D2)
GPIO27/SD2CLK2: U14.L1(GPIO27/OUTPUTXBAR4/EQEP2S/MFSXB/OUTPUTXBAR4/SPISTEB/SD2_C2)
GPIO28: U14.V11(GPIO28/SCIRXDA/EM1CS4/OUTPUTXBAR5/EQEP3A/SD2_D3)
GPIO29/OPXBAR6: U14.W11(GPIO29/SCITXDA/EM1SDCKE/OUTPUTXBAR6/EQEP3B/SD2_C3)
GPIO30: J9.46(RSVD1) U14.T11(GPIO30/CANRXA/EM1CLK/OUTPUTXBAR7/EQEP3S/SD2_D4)
GPIO31: J9.45(NWR) U14.U11(GPIO31/CANTXA/EM1WE/OUTPUTXBAR8/EQEP3I/SD2_C4)
GPIO32: J9.59(RSVD3) U14.U13(GPIO32/SDAA/EM1CS0)
GPIO33: J9.20(E2PROM_LOAD) U14.T13(GPIO33/SCLA/EM1RNW)
GPIO34: J9.43(CSN) U14.U14(GPIO34/OUTPUTXBAR1/EM1CS2/SDAB)
GPIO35: U14.T14(GPIO35/SCIRXDA/EM1CS3/SCLB)
GPIO36: J9.50(BUSY) U14.V16(GPIO36/SCITXDA/EM1WAIT/CANRXA)
GPIO37: J9.44(NRD) U14.U16(GPIO37/OUTPUTXBAR2/EM1OE/CANTXA)
GPIO38: J9.4(A2) U14.T16(GPIO38/EM1A0/SCITXDC/CANTXB)
GPIO39: J9.5(A3) U14.W17(GPIO39/EM1A1/SCIRXDC/CANRXB)
GPIO40/I2CSDAB: J13.2 U14.V17(GPIO40/EM1A2/SDAB)
GPIO40/I2CSDAB/J5: J13.3
GPIO40/I2CSDAB/J9: J9.6(A4) J13.1
GPIO41/I2CSCLB: J11.2 U14.U17(GPIO41/EM1A3/SCLB)
GPIO41/I2CSCLB/J5: J11.3
GPIO41/I2CSCLB/J9: J9.7(A5) J11.1
GPIO42/SCIATX(<-MCU): U14.D19(GPIO42/SDAA/SCITXDA/USB0DM)
GPIO44: J9.8(A6) U14.K18(GPIO44/EM1A4)
GPIO45: J9.9(A7) U14.K19(GPIO45/EM1A5)
GPIO46: J9.11(A8) U14.E19(GPIO46/EM1A6/SCIRXDD)
GPIO47: J9.12(A9) U14.E18(GPIO47/EM1A7/SCITXDD)
GPIO48: J9.13(A10) U14.R16(GPIO48/OUTPUTXBAR3/EM1A8/SCITXDA/SD1_D1)
GPIO49: J9.14(A11) U14.R17(GPIO49/OUTPUTXBAR4/EM1A9/SCIRXDA/SD1_C1)
GPIO50: J9.15(A12) U14.R18(GPIO50/EQEP1A/EM1A10/SPISIMOC/SD1_D2)
GPIO51: J9.16(A13) U14.R19(GPIO51/EQEP1B/EM1A11/SPISOMIC/SD1_C2)
GPIO69: J9.41(D15)
GPIO70: J9.40(D14)
GPIO71: J9.39(D13)
GPIO72: J9.38(D12)
GPIO73: J9.37(D11)
GPIO74: J9.36(D10)
GPIO75: J9.35(D9)
GPIO76: J9.34(D8)
GPIO77: J9.28(D7)
GPIO78: J9.27(D6/SPI_INT)
GPIO79: J9.26(D5)
GPIO80: J9.25(D4)
GPIO81: J9.24(D3)
GPIO82: J9.23(D2)
GPIO83: J9.22(D1)
GPIO85: J9.21(D0)
GPIO86: J9.47(SYNC/LATCH0)
GPIO87: J9.48(SYNC/LATCH1)
GPIO88: J9.17(A14)
GPIO89: J9.18(A15)
GPIO92: J9.3(A1)
GPIO93: J9.2(A0)
GPIO100: J9.32(SPI_SIMOA)
GPIO101: J9.33(SPI_SOMIA)
GPIO102: J9.31(SPI_CLK)
GPIO103: J9.30(SPI_SEL)
GPIO106: J9.54(I2C-SCL)
GPIO107: J9.49(EMIF_INT)
GPIO108: J9.60(ETRESETN)
GPIO109: J9.55(I2C-SDA)
GPIO117: J9.58(RSVD2)

### Notes on the sheet
- COMPANY:
- Texas
  Instruments Inc.
- Drawn
- Roy
- Checked
- Appeoved
- TITLE:
- Document Number:
- >DRAWING_NAME
- REV:
- 1.1
- Date:
- >LAST_DATE_TIME
- TMS320F28379D-IO2
- Sheet:
- >SHEET
- 1
- 2
- 3
- 4
- 5
- 6
- A
- B
- C
- D
- E

### Library data of the parts
J11 J13 = MA03-1: <b>PIN HEADER</b>; OC_FARNELL: unknown; OC_NEWARK: unknown

## Sheet LAUNCHXL-F28379D_9.SchDoc
size 301 x 239 mm
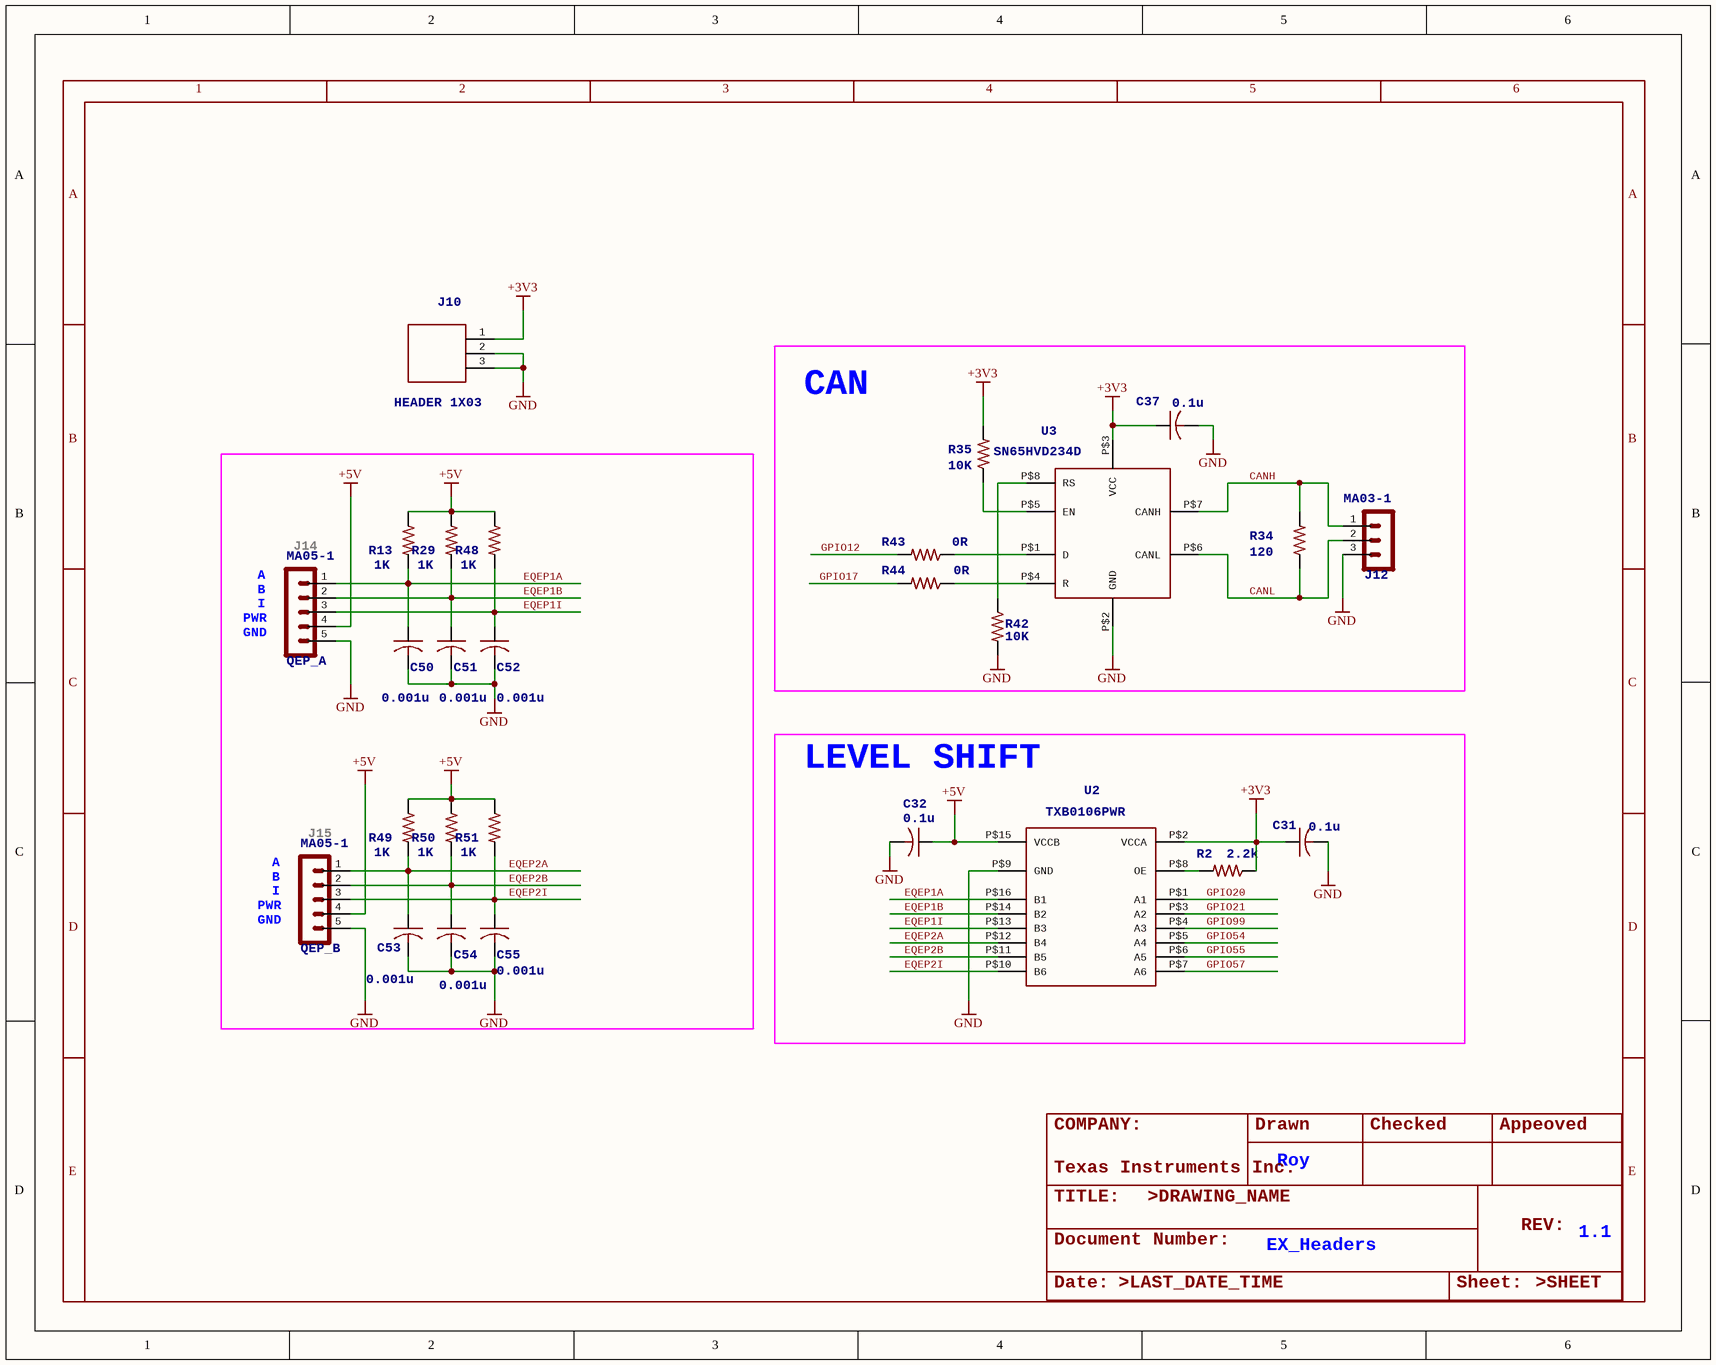
[diagram p9: LAUNCHXL-F28379D_9.SchDoc]

### Parts
C31  0.1u  [C0402]
C32  0.1u  [C0402]
C37  0.1u  [C0402]
C50  0.001u  [C0402]
C51  0.001u  [C0402]
C52  0.001u  [C0402]
C53  0.001u  [C0402]
C54  0.001u  [C0402]
C55  0.001u  [C0402]
J10  HEADER 1X03  [3PIN_PWR_3V3]
J12  MA03-1  [MA03-1]
QEP_A  MA05-1  [MA05-1]
QEP_B  MA05-1  [MA05-1]
R2  2.2k  [R0402]
R13  1K  [R0402]
R29  1K  [R0402]
R34  120  [R0402]
R35  10K  [R0402]
R42  10K  [R0402]
R43  0R  [R0402]
R44  0R  [R0402]
R48  1K  [R0402]
R49  1K  [R0402]
R50  1K  [R0402]
R51  1K  [R0402]
U2  TXB0106PWR  [TSSOP16-PW]
U3  SN65HVD234D  [SOIC8-PDSO]

### Blocks framed on the sheet
CAN: C37 J12 R34 R35 R42-R44 U3
LEVEL SHIFT: C31 C32 R2 U2

### Nets
+3V3: C31.1 C37.1 J10.1 R2.1 R35.2 U2.P$2(VCCA) U3.P$3(VCC)  [project net GPIO43/SCIARX(->MCU)]
+5V: C32.1 QEP_A.4 QEP_B.4 R13.1 R29.1 R48.1 R49.1 R50.1 R51.1 U2.P$15(VCCB)
GND: C31.2 C32.2 C37.2 C50.2 C51.2 C52.2 C53.2 C54.2 C55.2 J10.2 J10.3 J12.3 QEP_A.5 QEP_B.5 R42.2 U2.P$9(GND) U3.P$2(GND)
CANH: J12.1 R34.2 U3.P$7(CANH)
CANL: J12.2 R34.1 U3.P$6(CANL)
EQEP1A: C50.1 QEP_A.1 R13.2 U2.P$16(B1)
EQEP1B: C51.1 QEP_A.2 R29.2 U2.P$14(B2)
EQEP1I: C52.1 QEP_A.3 R48.2 U2.P$13(B3)
EQEP2A: C53.1 QEP_B.1 R49.2 U2.P$12(B4)
EQEP2B: C54.1 QEP_B.2 R50.2 U2.P$11(B5)
EQEP2I: C55.1 QEP_B.3 R51.2 U2.P$10(B6)
GPIO12: R43.2
GPIO17: R44.2
GPIO20: U2.P$1(A1)
GPIO21: U2.P$3(A2)
GPIO54: U2.P$5(A4)
GPIO55: U2.P$6(A5)
GPIO57: U2.P$7(A6)
GPIO99: U2.P$4(A3)
NetR2_2: R2.2 U2.P$8(OE)
NetR35_1: R35.1 U3.P$5(EN)
NetR42_1: R42.1 U3.P$8(RS)
NetR43_1: R43.1 U3.P$1(D)
NetR44_1: R44.1 U3.P$4(R)

### Notes on the sheet
- (near QEP_A) A
- (near QEP_A) B
- (near QEP_A) J14
- (near QEP_A) GND
- (near QEP_A) PWR
- (near QEP_A) I
- (near QEP_B) A
- (near QEP_B) B
- (near QEP_B) J15
- (near QEP_B) GND
- (near QEP_B) PWR
- (near QEP_B) I
- COMPANY:
- Texas
  Instruments Inc.
- Drawn
- Roy
- Checked
- Appeoved
- TITLE:
- Document Number:
- >DRAWING_NAME
- REV:
- 1.1
- Date:
- >LAST_DATE_TIME
- EX_Headers
- Sheet:
- >SHEET
- 1
- 2
- 3
- 4
- 5
- 6
- C
- D
- E

### Library data of the parts
C31 C32 C37 C50-C55 = C-USC0402: <B>CAPACITOR</B>, American symbol
J10 = BP_HEADERS_PWR_3V3-TH
J12 = MA03-1: <b>PIN HEADER</b>
QEP_A QEP_B = MA05-1: <b>PIN HEADER</b>
R2 R13 R29 R34 R35 R42-R44 R48-R51 = R-US_R0402: <B>RESISTOR</B>, American symbol

## Nets that join several sheets
+5V: LAUNCHXL-F28379D_1 (JP3.2), LAUNCHXL-F28379D_2 (8 pins), LAUNCHXL-F28379D_5 (J3.21 JP5.2), LAUNCHXL-F28379D_9 (10 pins)
GND: LAUNCHXL-F28379D_1 (6 pins), LAUNCHXL-F28379D_2 (55 pins), LAUNCHXL-F28379D_3 (19 pins), LAUNCHXL-F28379D_4 (6 pins), LAUNCHXL-F28379D_5 (J2.20 J3.22 J6.20 J7.22), LAUNCHXL-F28379D_6 (84 pins), LAUNCHXL-F28379D_8 (6 pins), LAUNCHXL-F28379D_9 (17 pins)
GPIO43/SCIARX(->MCU): LAUNCHXL-F28379D_1 (10 pins), LAUNCHXL-F28379D_2 (13 pins), LAUNCHXL-F28379D_3 (C83.1 U1.P$3 U1.P$7), LAUNCHXL-F28379D_4 (C24.1 R38.2 R39.2 U9.5), LAUNCHXL-F28379D_5 (J1.1 JP4.2), LAUNCHXL-F28379D_6 (6 pins), LAUNCHXL-F28379D_8 (5 pins), LAUNCHXL-F28379D_9 (7 pins)
ADCIN14/ANALOGIN: LAUNCHXL-F28379D_5 (J3.23), LAUNCHXL-F28379D_8 (U14.T4)
ADCIN15/ANALOGIN: LAUNCHXL-F28379D_5 (J7.23), LAUNCHXL-F28379D_8 (U14.U4)
ADCINA0/ANALOGIN(DACA): LAUNCHXL-F28379D_5 (J3.30), LAUNCHXL-F28379D_8 (U14.U1)
ADCINA1/ANALOGIN(DACB): LAUNCHXL-F28379D_5 (J7.30), LAUNCHXL-F28379D_8 (U14.T1)
ADCINA2/ANALOGIN: LAUNCHXL-F28379D_5 (J3.29), LAUNCHXL-F28379D_8 (U14.U2)
ADCINA3/ANALOGIN: LAUNCHXL-F28379D_5 (J3.26), LAUNCHXL-F28379D_8 (U14.T2)
ADCINA4/ANALOGIN: LAUNCHXL-F28379D_5 (J7.29), LAUNCHXL-F28379D_8 (U14.U3)
ADCINA5/ANALOGIN: LAUNCHXL-F28379D_5 (J7.26), LAUNCHXL-F28379D_8 (U14.T3)
ADCINB2/ANALOGIN: LAUNCHXL-F28379D_5 (J3.28), LAUNCHXL-F28379D_8 (U14.V3)
ADCINB3/ANALOGIN: LAUNCHXL-F28379D_5 (J3.25), LAUNCHXL-F28379D_8 (U14.W3)
ADCINB4/ANALOGIN: LAUNCHXL-F28379D_5 (J7.28), LAUNCHXL-F28379D_8 (U14.V4)
ADCINB5/ANALOGIN: LAUNCHXL-F28379D_5 (J7.25), LAUNCHXL-F28379D_8 (U14.W4)
ADCINC2/ANALOGIN: LAUNCHXL-F28379D_5 (J3.27), LAUNCHXL-F28379D_8 (U14.R3)
ADCINC3/ANALOGIN: LAUNCHXL-F28379D_5 (J3.24), LAUNCHXL-F28379D_8 (U14.P3)
ADCINC4/ANALOGIN: LAUNCHXL-F28379D_5 (J7.27), LAUNCHXL-F28379D_8 (U14.R4)
ADCINC5/ANALOGIN: LAUNCHXL-F28379D_5 (J7.24), LAUNCHXL-F28379D_8 (U14.P4)
ADCIND0: LAUNCHXL-F28379D_3 (J21.1), LAUNCHXL-F28379D_8 (U14.T5)
ADCIND1: LAUNCHXL-F28379D_3 (J21.3), LAUNCHXL-F28379D_8 (U14.U5)
ADCIND2: LAUNCHXL-F28379D_3 (J21.5), LAUNCHXL-F28379D_8 (U14.T6)
ADCIND3: LAUNCHXL-F28379D_3 (J21.7), LAUNCHXL-F28379D_8 (U14.U6)
ADCIND4: LAUNCHXL-F28379D_3 (C40.1 R58.1), LAUNCHXL-F28379D_8 (U14.T7)
ADCIND5: LAUNCHXL-F28379D_3 (C40.2 R65.1), LAUNCHXL-F28379D_8 (U14.U7)
GPIO0/PWMOUT1A: LAUNCHXL-F28379D_5 (J4.40), LAUNCHXL-F28379D_8 (U14.C8)
GPIO1/PWMOUT1B: LAUNCHXL-F28379D_5 (J4.39), LAUNCHXL-F28379D_8 (U14.D8)
GPIO2//PWMOUT2A: LAUNCHXL-F28379D_5 (J4.38), LAUNCHXL-F28379D_8 (U14.A7)
GPIO3/PWMOUT2B: LAUNCHXL-F28379D_5 (J4.37), LAUNCHXL-F28379D_8 (U14.B7)
GPIO4/PWMOUT3A: LAUNCHXL-F28379D_5 (J4.36), LAUNCHXL-F28379D_8 (U14.C7)
GPIO5/PWMOUT3B: LAUNCHXL-F28379D_5 (J4.35), LAUNCHXL-F28379D_8 (U14.D7)
GPIO6/PWMOUT4A: LAUNCHXL-F28379D_5 (J8.40), LAUNCHXL-F28379D_8 (U14.A6)
GPIO7/PWMOUT4B: LAUNCHXL-F28379D_5 (J8.39), LAUNCHXL-F28379D_8 (U14.B6)
GPIO8/PWMOUT5A: LAUNCHXL-F28379D_5 (J8.38), LAUNCHXL-F28379D_8 (U14.G2)
GPIO9/PWMOUT5B: LAUNCHXL-F28379D_5 (J8.37), LAUNCHXL-F28379D_8 (U14.G3)
GPIO10/PWMOUT6A: LAUNCHXL-F28379D_5 (J8.36), LAUNCHXL-F28379D_8 (U14.B2)
GPIO11/PWMOUT6B: LAUNCHXL-F28379D_5 (J8.35), LAUNCHXL-F28379D_8 (U14.C1)
GPIO12: LAUNCHXL-F28379D_8 (U14.C2), LAUNCHXL-F28379D_9 (R43.2)
GPIO14/OPXBAR3: LAUNCHXL-F28379D_5 (J8.34), LAUNCHXL-F28379D_8 (U14.D2)
GPIO15/OPXBAR4: LAUNCHXL-F28379D_5 (J8.33), LAUNCHXL-F28379D_8 (U14.D3)
GPIO16/OPXBAR7: LAUNCHXL-F28379D_5 (J4.33), LAUNCHXL-F28379D_8 (U14.E1)
GPIO17: LAUNCHXL-F28379D_8 (U14.E2), LAUNCHXL-F28379D_9 (R44.2)
GPIO18: LAUNCHXL-F28379D_5 (J1.4), LAUNCHXL-F28379D_8 (U14.E3)
GPIO19: LAUNCHXL-F28379D_5 (J1.3), LAUNCHXL-F28379D_8 (U14.E4)
GPIO20: LAUNCHXL-F28379D_8 (U14.F2), LAUNCHXL-F28379D_9 (U2.P$1)
GPIO21: LAUNCHXL-F28379D_8 (U14.F3), LAUNCHXL-F28379D_9 (U2.P$3)
GPIO22: LAUNCHXL-F28379D_5 (J1.8), LAUNCHXL-F28379D_8 (U14.J4)
GPIO24/OPXBAR1: LAUNCHXL-F28379D_5 (J4.34), LAUNCHXL-F28379D_8 (U14.K3)
GPIO25/OPXBAR2: LAUNCHXL-F28379D_5 (J6.11), LAUNCHXL-F28379D_8 (U14.K2)
GPIO26/SD2D2: LAUNCHXL-F28379D_5 (J6.13), LAUNCHXL-F28379D_8 (U14.K1)
GPIO27/SD2CLK2: LAUNCHXL-F28379D_5 (J6.12), LAUNCHXL-F28379D_8 (U14.L1)
GPIO29/OPXBAR6: LAUNCHXL-F28379D_5 (J2.11), LAUNCHXL-F28379D_8 (U14.W11)
GPIO31: LAUNCHXL-F28379D_4 (U9.3), LAUNCHXL-F28379D_8 (J9.45 U14.U11)
GPIO32: LAUNCHXL-F28379D_5 (J1.2), LAUNCHXL-F28379D_8 (J9.59 U14.U13)
GPIO34: LAUNCHXL-F28379D_4 (U9.1), LAUNCHXL-F28379D_8 (J9.43 U14.U14)
GPIO40/I2CSDAB/J5: LAUNCHXL-F28379D_5 (J5.10), LAUNCHXL-F28379D_8 (J13.3)
GPIO41/I2CSCLB/J5: LAUNCHXL-F28379D_5 (J5.9), LAUNCHXL-F28379D_8 (J11.3)
GPIO42/SCIATX(<-MCU): LAUNCHXL-F28379D_1 (R30.2 U7.4), LAUNCHXL-F28379D_8 (U14.D19)
GPIO52: LAUNCHXL-F28379D_5 (J5.8), LAUNCHXL-F28379D_7 (U14.P16)
GPIO54: LAUNCHXL-F28379D_7 (U14.P18), LAUNCHXL-F28379D_9 (U2.P$5)
GPIO55: LAUNCHXL-F28379D_7 (U14.P19), LAUNCHXL-F28379D_9 (U2.P$6)
GPIO56/SCICIX(<-MCU): LAUNCHXL-F28379D_5 (J5.4), LAUNCHXL-F28379D_7 (U14.N16)
GPIO57: LAUNCHXL-F28379D_7 (U14.N18), LAUNCHXL-F28379D_9 (U2.P$7)
GPIO58/SPIAMOSI: LAUNCHXL-F28379D_5 (J2.15), LAUNCHXL-F28379D_7 (U14.N17)
GPIO59/SPIAMISO: LAUNCHXL-F28379D_5 (J2.14), LAUNCHXL-F28379D_7 (U14.M16)
GPIO60/SPICLKA: LAUNCHXL-F28379D_5 (J1.7), LAUNCHXL-F28379D_7 (U14.M17)
GPIO61/SPIACS: LAUNCHXL-F28379D_5 (J2.19), LAUNCHXL-F28379D_7 (U14.L16)
GPIO63/SPIBMOSI: LAUNCHXL-F28379D_5 (J6.15), LAUNCHXL-F28379D_7 (U14.J16)
GPIO64/SPIBMISO: LAUNCHXL-F28379D_5 (J6.14), LAUNCHXL-F28379D_7 (U14.L17)
GPIO65/SPIBCLK: LAUNCHXL-F28379D_5 (J5.7), LAUNCHXL-F28379D_7 (U14.K16)
GPIO66/SPIBCS: LAUNCHXL-F28379D_5 (J6.19), LAUNCHXL-F28379D_7 (U14.K17)
GPIO67: LAUNCHXL-F28379D_5 (J1.5), LAUNCHXL-F28379D_7 (U14.B19)
GPIO69: LAUNCHXL-F28379D_7 (U14.B18), LAUNCHXL-F28379D_8 (J9.41)
GPIO70: LAUNCHXL-F28379D_7 (U14.A17), LAUNCHXL-F28379D_8 (J9.40)
GPIO71: LAUNCHXL-F28379D_7 (U14.B17), LAUNCHXL-F28379D_8 (J9.39)
GPIO72: LAUNCHXL-F28379D_6 (R9.2 S1.2), LAUNCHXL-F28379D_7 (U14.B16), LAUNCHXL-F28379D_8 (J9.38)
GPIO73: LAUNCHXL-F28379D_7 (U14.A16), LAUNCHXL-F28379D_8 (J9.37)
GPIO74: LAUNCHXL-F28379D_7 (U14.C17), LAUNCHXL-F28379D_8 (J9.36)
GPIO75: LAUNCHXL-F28379D_7 (U14.D16), LAUNCHXL-F28379D_8 (J9.35)
GPIO76: LAUNCHXL-F28379D_7 (U14.C16), LAUNCHXL-F28379D_8 (J9.34)
GPIO77: LAUNCHXL-F28379D_7 (U14.A15), LAUNCHXL-F28379D_8 (J9.28)
GPIO78: LAUNCHXL-F28379D_7 (U14.B15), LAUNCHXL-F28379D_8 (J9.27)
GPIO79: LAUNCHXL-F28379D_7 (U14.C15), LAUNCHXL-F28379D_8 (J9.26)
GPIO80: LAUNCHXL-F28379D_7 (U14.D15), LAUNCHXL-F28379D_8 (J9.25)
GPIO81: LAUNCHXL-F28379D_7 (U14.A14), LAUNCHXL-F28379D_8 (J9.24)
GPIO82: LAUNCHXL-F28379D_7 (U14.B14), LAUNCHXL-F28379D_8 (J9.23)
GPIO83: LAUNCHXL-F28379D_7 (U14.C14), LAUNCHXL-F28379D_8 (J9.22)
GPIO84: LAUNCHXL-F28379D_6 (R8.2 S1.1), LAUNCHXL-F28379D_7 (U14.A11)
GPIO85: LAUNCHXL-F28379D_7 (U14.B11), LAUNCHXL-F28379D_8 (J9.21)
GPIO86: LAUNCHXL-F28379D_7 (U14.C11), LAUNCHXL-F28379D_8 (J9.47)
GPIO87: LAUNCHXL-F28379D_7 (U14.D11), LAUNCHXL-F28379D_8 (J9.48)
GPIO88: LAUNCHXL-F28379D_7 (U14.C6), LAUNCHXL-F28379D_8 (J9.17)
GPIO89: LAUNCHXL-F28379D_7 (U14.D6), LAUNCHXL-F28379D_8 (J9.18)
GPIO92: LAUNCHXL-F28379D_7 (U14.A4), LAUNCHXL-F28379D_8 (J9.3)
GPIO93: LAUNCHXL-F28379D_7 (U14.B4), LAUNCHXL-F28379D_8 (J9.2)
GPIO94: LAUNCHXL-F28379D_5 (J5.6), LAUNCHXL-F28379D_7 (U14.A3)
GPIO95: LAUNCHXL-F28379D_5 (J5.2), LAUNCHXL-F28379D_7 (U14.B3)
GPIO97: LAUNCHXL-F28379D_5 (J5.5), LAUNCHXL-F28379D_7 (U14.A2)
GPIO99: LAUNCHXL-F28379D_7 (U14.G1), LAUNCHXL-F28379D_9 (U2.P$4)
GPIO100: LAUNCHXL-F28379D_7 (U14.H1), LAUNCHXL-F28379D_8 (J9.32)
GPIO101: LAUNCHXL-F28379D_7 (U14.H2), LAUNCHXL-F28379D_8 (J9.33)
GPIO102: LAUNCHXL-F28379D_7 (U14.H3), LAUNCHXL-F28379D_8 (J9.31)
GPIO103: LAUNCHXL-F28379D_7 (U14.J1), LAUNCHXL-F28379D_8 (J9.30)
GPIO104/I2CSDAA: LAUNCHXL-F28379D_5 (J1.10), LAUNCHXL-F28379D_7 (U14.J2)
GPIO105/I2CSCLA: LAUNCHXL-F28379D_5 (J1.9), LAUNCHXL-F28379D_7 (U14.J3)
GPIO106: LAUNCHXL-F28379D_7 (U14.L2), LAUNCHXL-F28379D_8 (J9.54)
GPIO107: LAUNCHXL-F28379D_7 (U14.L3), LAUNCHXL-F28379D_8 (J9.49)
GPIO108: LAUNCHXL-F28379D_7 (U14.L4), LAUNCHXL-F28379D_8 (J9.60)
GPIO109: LAUNCHXL-F28379D_7 (U14.N2), LAUNCHXL-F28379D_8 (J9.55)
GPIO111: LAUNCHXL-F28379D_5 (J1.6), LAUNCHXL-F28379D_7 (U14.M4)
GPIO117: LAUNCHXL-F28379D_7 (U14.U12), LAUNCHXL-F28379D_8 (J9.58)
GPIO122/SD1D1: LAUNCHXL-F28379D_5 (J2.17), LAUNCHXL-F28379D_7 (U14.T8)
GPIO123/SD1CLK1: LAUNCHXL-F28379D_5 (J2.18), LAUNCHXL-F28379D_7 (U14.U8)
GPIO124/SD1D2: LAUNCHXL-F28379D_5 (J2.13), LAUNCHXL-F28379D_7 (U14.V8)
GPIO125/SD1CLK2: LAUNCHXL-F28379D_5 (J2.12), LAUNCHXL-F28379D_7 (U14.T9)
GPIO130/SD2D1: LAUNCHXL-F28379D_5 (J6.17), LAUNCHXL-F28379D_7 (U14.U10)
GPIO131/SD2CLK1: LAUNCHXL-F28379D_5 (J6.18), LAUNCHXL-F28379D_7 (U14.V10)
GPIO139/SCICRX(->MCU): LAUNCHXL-F28379D_5 (J5.3), LAUNCHXL-F28379D_7 (U14.N19)
GPIO157: LAUNCHXL-F28379D_4 (R40.1), LAUNCHXL-F28379D_7 (U14.B10)
GPIO158: LAUNCHXL-F28379D_4 (R41.1), LAUNCHXL-F28379D_7 (U14.C10)
GPIO159: LAUNCHXL-F28379D_4 (R36.1), LAUNCHXL-F28379D_7 (U14.D10)
GPIO160: LAUNCHXL-F28379D_4 (R37.1), LAUNCHXL-F28379D_7 (U14.B9)
JTAG_TRST: LAUNCHXL-F28379D_1 (R28.2 U7.5), LAUNCHXL-F28379D_6 (S1.4)
PWM/BASED/DAC1: LAUNCHXL-F28379D_4 (C36.1 R36.2), LAUNCHXL-F28379D_5 (J4.32)
PWM/BASED/DAC2: LAUNCHXL-F28379D_4 (C33.1 R37.2), LAUNCHXL-F28379D_5 (J4.31)
PWM/BASED/DAC3: LAUNCHXL-F28379D_4 (C34.1 R40.2), LAUNCHXL-F28379D_5 (J8.32)
PWM/BASED/DAC4: LAUNCHXL-F28379D_4 (C35.1 R41.2), LAUNCHXL-F28379D_5 (J8.31)
RESET#: LAUNCHXL-F28379D_5 (J2.16 J6.16), LAUNCHXL-F28379D_6 (5 pins)
TCK: LAUNCHXL-F28379D_1 (R20.2 U5.14), LAUNCHXL-F28379D_6 (U14.V15)
TDI: LAUNCHXL-F28379D_1 (R19.2 U5.13), LAUNCHXL-F28379D_6 (U14.W13)
TDO: LAUNCHXL-F28379D_1 (R32.2 U7.3), LAUNCHXL-F28379D_6 (U14.W15)
TMS: LAUNCHXL-F28379D_1 (R18.2 U5.12), LAUNCHXL-F28379D_6 (U14.W14)
VDD: LAUNCHXL-F28379D_2 (11 pins), LAUNCHXL-F28379D_6 (14 pins)
VDDA: LAUNCHXL-F28379D_2 (C27.1 C28.1 C30.1 L3.2), LAUNCHXL-F28379D_6 (U14.P6 U14.R6)
VDDIO: LAUNCHXL-F28379D_2 (15 pins), LAUNCHXL-F28379D_6 (29 pins)
VDDOSC: LAUNCHXL-F28379D_2 (C71.1 C73.1 C74.1 L4.2), LAUNCHXL-F28379D_6 (U14.H16 U14.H17)
VREFHIA: LAUNCHXL-F28379D_2 (R11.2 U19.P$2 U19.P$6), LAUNCHXL-F28379D_6 (U14.R1 U14.V1)
VREFHIB: LAUNCHXL-F28379D_2 (R52.2 U11.P$2 U11.P$6), LAUNCHXL-F28379D_6 (U14.V5 U14.W5)